# EasyEDA Pro project SK_SDVX.epro

# Schematic Controller
Board Name: ControllerBoard; Create Date: 2025-06-14; Page Name: P1; Project Name: SK_SDVX; Schematic Name: Schematic2; Update Date: 2025-06-22; Company: 嘉立创EDA
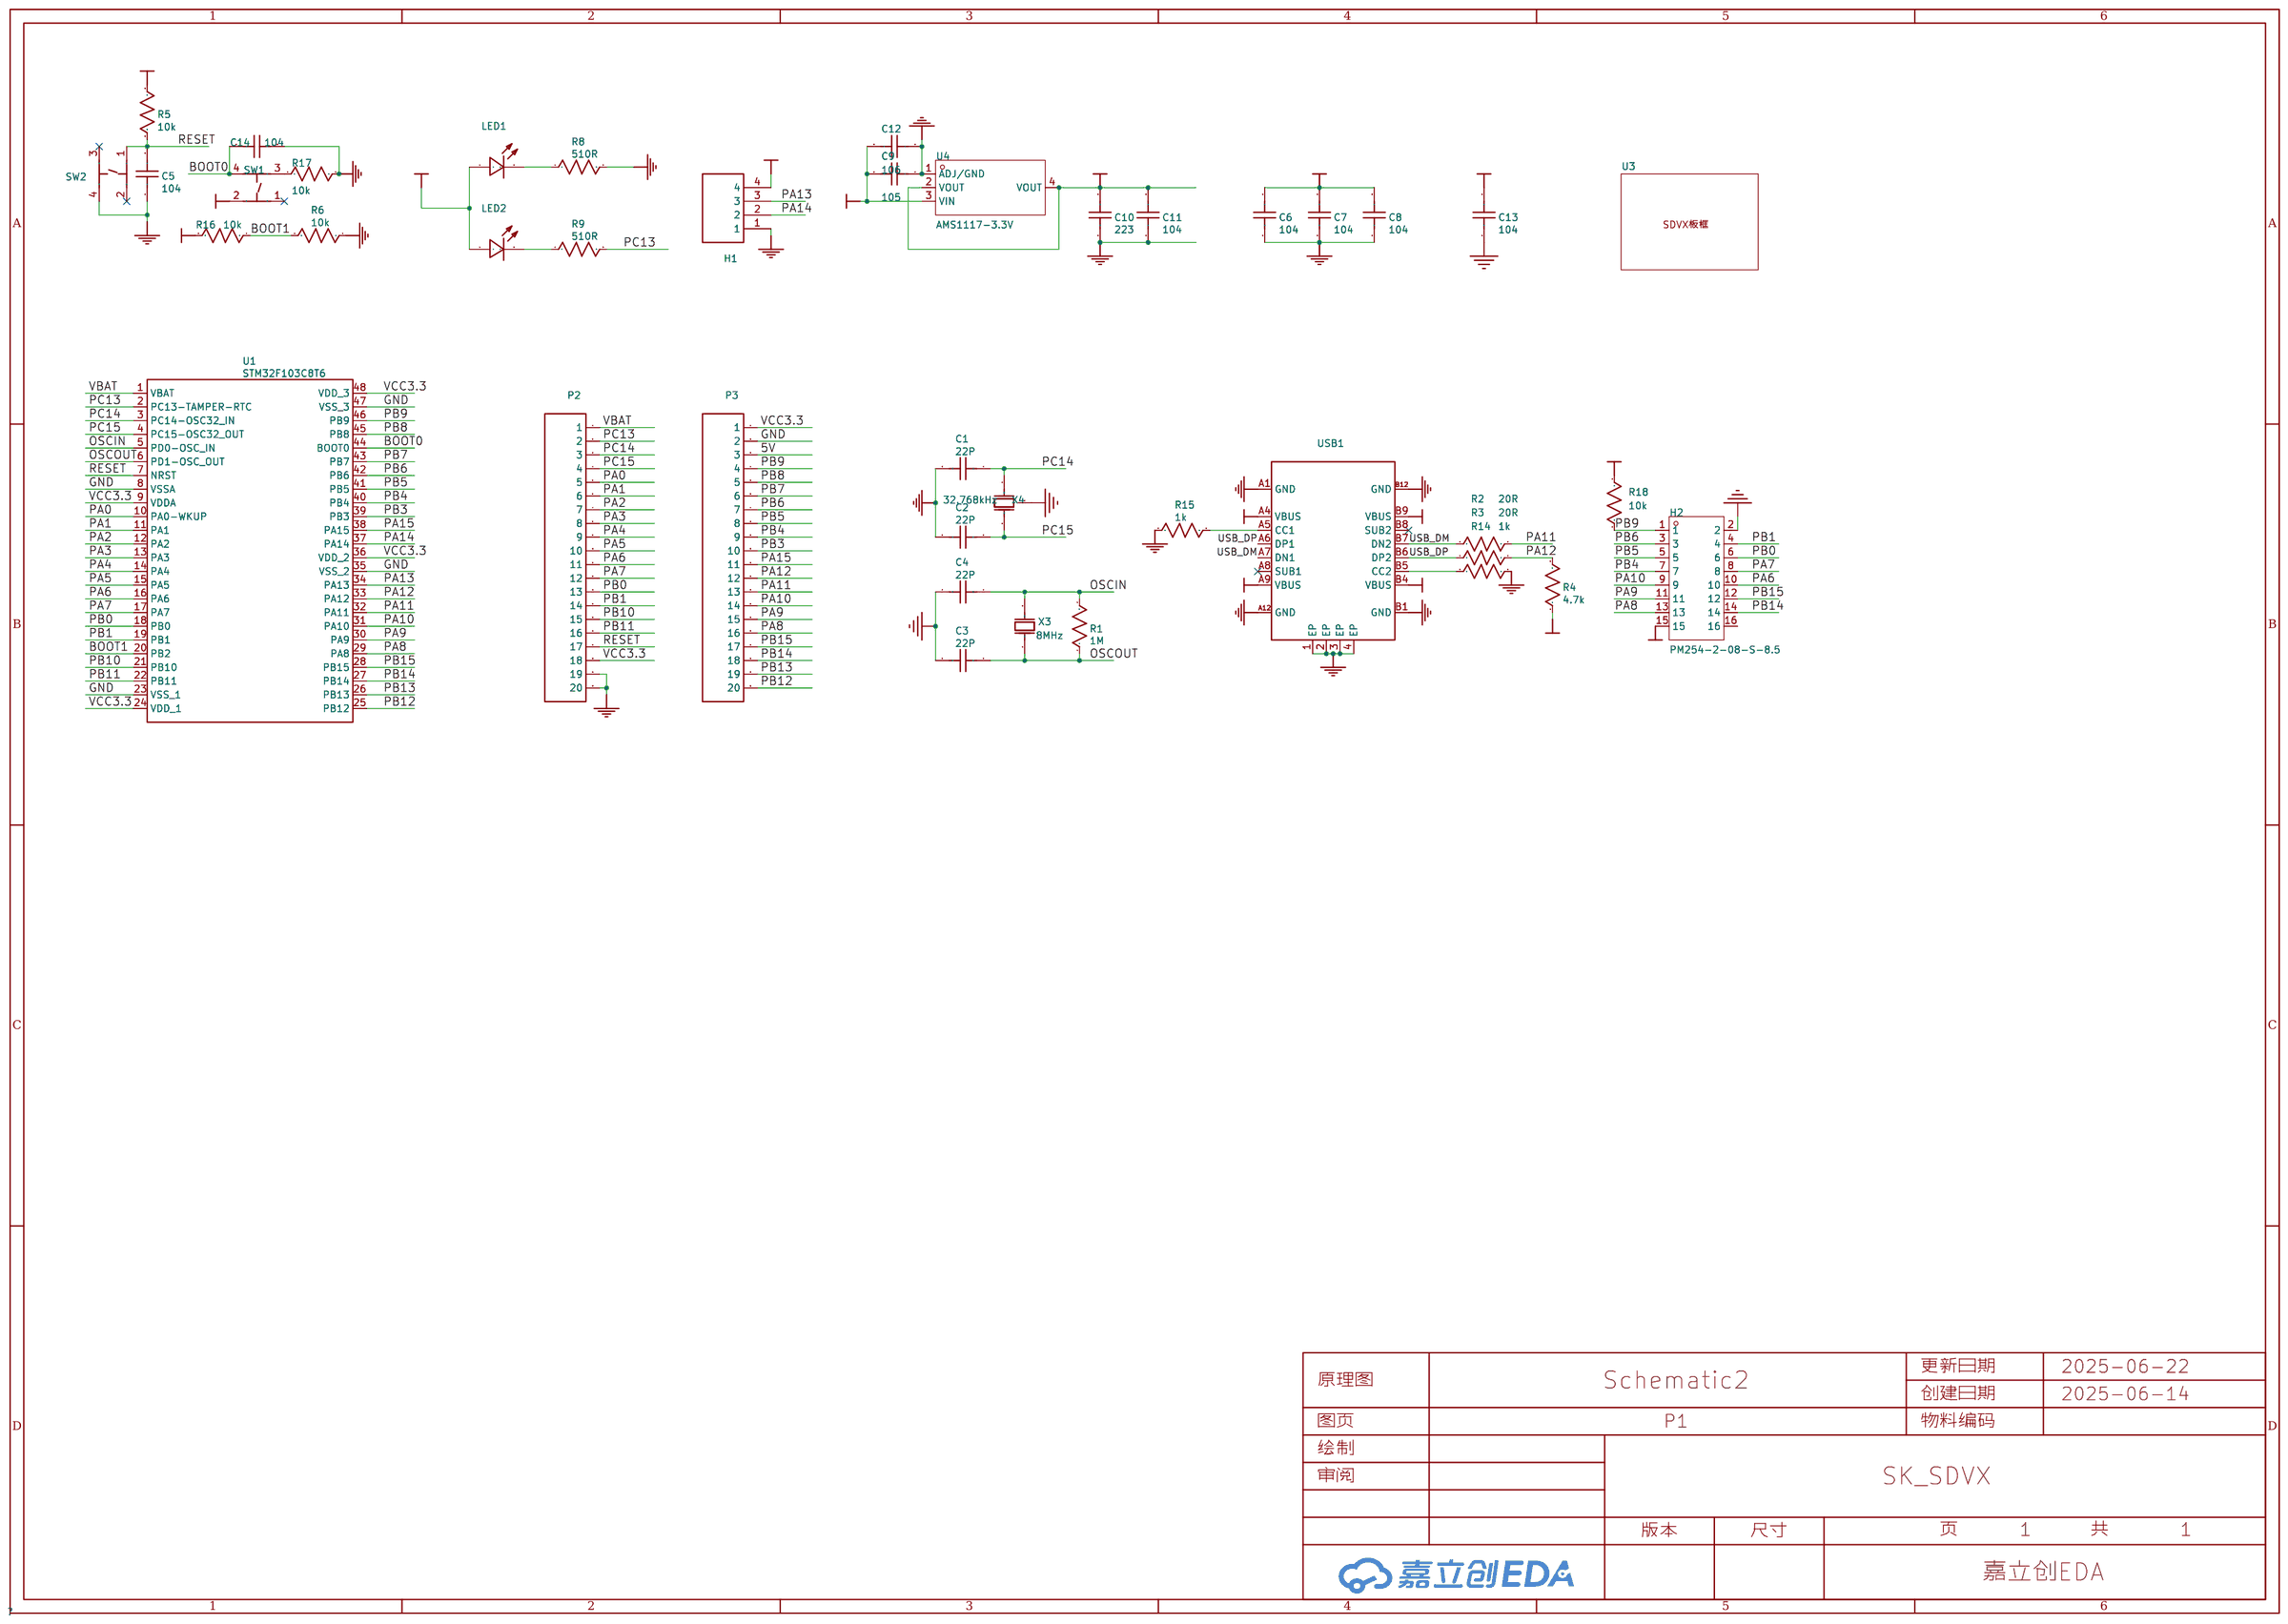
[diagram p0: schematic sheet]

## Parts
C1  22P  [C0603]
C2  22P  [C0603]
C3  22P  [C0603]
C4  22P  [C0603]
C5  104  [C0603]
C6  104  [C0603]
C7  104  [C0603]
C8  104  [C0603]
C9  105  [C0603]
C10  223  [C0603]
C11  104  [C0603]
C12  106  [C0603]
C13  104  [C0603]
C14  104  [C0603]
H1  220S-1*4P H=8.5MM Ytype Gold-plated  [DIP-1X4P2.54]
H2  PM254-2-08-S-8.5  [HDR-SMD_16P-P2.54-V-F-R2-C8-LS7.1]
LED1  204-10SURD/S530-A3  [LED0805-RD]
LED2  204-10SURD/S530-A3  [LED0805-RD]
P2  Header-Female-2.54_1x20  [HDR-TH_20P-P2.54-V]
P3  Header-Female-2.54_1x20  [HDR-TH_20P-P2.54-V]
R1  1M  [R0603]
R2  20R  [R0603]
R3  20R  [R0603]
R4  4.7k  [R0603]
R5  10k  [R0603]
R6  10k  [R0603]
R8  510R  [R0603]
R9  510R  [R0603]
R14  1k  [R0603]
R15  1k  [R0603]
R16  10k  [R0603]
R17  10k  [R0603]
R18  10k  [R0603]
SW1  3.7*3.7*0.8  [SW-SMD_4P-L3.7-W3.7-P2.75-LS3.7]
SW2  3.7*3.7*0.8  [SW-SMD_4P-L3.7-W3.7-P2.75-LS3.7]
U1  STM32F103C8T6  [LQFP-48_L7.0-W7.0-P0.50-LS9.0-BL]
U3  -  [SDVX台板框]
U4  AMS1117-3.3V  [SOT-223-4_L6.5-W3.5-P2.30-LS7.0-TR]
USB1  TYPE-C-16P  [USB-C-SMD_KH-TYPE-C-16P]
X3  8MHz  [HC-49US_L11.5-W4.5-P4.88]
X4  32.768kHz  [OSC-SMD_BD2.0-P2.54_TMXLI-206F32.768KHZ12.5PF20PPM]

## Library data of the parts
C1-C4 = 22P: nameAlias: Value(F); spicePre: C; spiceSymbolName: Cap_RAD-0.1_US
C5-C8 C11 C13 C14 = 104: nameAlias: Value(F); spicePre: C; spiceSymbolName: Cap_RAD-0.1_US
C9 = 105: nameAlias: Value(F); spicePre: C; spiceSymbolName: Cap_RAD-0.1_US
C10 = 223: nameAlias: Value(F); spicePre: C; spiceSymbolName: Cap_RAD-0.1_US
C12 = 106: nameAlias: Value(F); spicePre: C; spiceSymbolName: Cap_RAD-0.1_US
H1 = 220S-1*4P H=8.5MM Ytype Gold-plated: Supplier: LCSC; Manufacturer: Ckmtw; Supplier Part: C124413; Contributor: LCSC; spicePre: H
H2 = PM254-2-08-S-8.5: 插孔结构:2x8P;间距:2.54mm;行距:2.54mm;圆孔/方孔:方孔;安装类型:立贴;排数:双排;总孔位数:16P;额定电流:3A;插孔方向:顶部;塑高:8.5mm;触头材质:铜合金;工作温度范围:-40℃~+105℃;焊接温度(最大值):260℃@5S;; LCSC Part Name: 2x8P 间距:2.54mm 立贴; Supplier Part: C3975153; Manufacturer: HCTL(华灿天禄); Supplier Footprint: SMD,P=2.54mm; JLCPCB Part Class: 扩展库; Datasheet: https://atta.szlcsc.com/upload/public/pdf/source/20230609/7C6F8D8E301C6BBC8F19D55951C36597.pdf; Supplier: LCSC; Holes Structure: 2x8P; Pitch: 2.54mm; Row Spacing: 2.54mm; Circular Hole / Square Hole: 方孔; Mounting Type: 立贴; Number of Rows: 双排; Number of Holes: 16P; Current Rating (Max): 3A; Holes Direction: 顶部; Insulation Height: 8.5mm; Contact Material: 铜合金; Operating Temperature Range: -40℃~+105℃; Soldering Temperature(Max): 260℃@5S
LED1 LED2 = 204-10SURD/S530-A3: Supplier: LCSC; Manufacturer: EVERLIGHT; Supplier Part: C99772; spicePre: L
P2 P3 = 2.54mm 1*20P Female header: Supplier: LCSC; Manufacturer: BOOMELE; Supplier Part: C50984; spicePre: P
R1 = 1M: nameAlias: Value(Ω); spicePre: R; spiceSymbolName: Res_AXIAL-0.3(1/8W)_US
R2 R3 = 20R: nameAlias: Value(Ω); spicePre: R; spiceSymbolName: Res_AXIAL-0.3(1/8W)_US
R4 = 4.7k: nameAlias: Value(Ω); spicePre: R; spiceSymbolName: Res_AXIAL-0.3(1/8W)_US
R5 R6 R16 R17 = 10k: nameAlias: Value(Ω); spicePre: R; spiceSymbolName: Res_AXIAL-0.3(1/8W)_US
R8 R9 = 510R: nameAlias: Value(Ω); spicePre: R; spiceSymbolName: Res_AXIAL-0.3(1/8W)_US
R14 R15 R18 = 1k: nameAlias: Value(Ω); Contributor: LCEDA_Lib; spicePre: R; spiceSymbolName: R_0603_US
SW1 SW2 = 3.7*3.7*0.8: Supplier: LCSC; Supplier Part: C2888445; Manufacturer: BZCN(博众电气); Manufacturer Part: TSA005A3518A02; JLCPCB Part Class: Extended Part; Contributor: LCSC; spicePre: S; spiceSymbolName: TSA005A3518A02
U1 = STM32F103C8T6: Supplier: LCSC; Manufacturer: STMicroelectronics; image: //image.lceda.cn/szlcsc/C8734.jpg; Supplier Part: C8734; JLCPCB Part Class: Basic; timeStamp: 1455028086; spicePre: U
U3 = SDVX台板框
U4 = AMS1117-3.3V: 输出类型:固定;最大输入电压:18V;输出电压:3.3V;最大输出电流:1A;输出极性:正极;; LCSC Part Name: 输入18V 输出3.3V 1A; Supplier Part: C5120765; Manufacturer: MSKSEMI(美森科); Supplier Footprint: SOT-223; JLCPCB Part Class: 扩展库; Datasheet: https://atta.szlcsc.com/upload/public/pdf/source/20230802/7000FCAFF33971783A269E7BD69EFE08.pdf; Supplier: LCSC; Output Type: 固定; Maximum Input Voltage: 18V; Output Voltage: 3.3V; MAX Output Current: 1A; Dropout Voltage: 1.4V@(1A); standby current: 12mA; Operating Temperature: 0℃~+125℃; Output Polarity: 正极; Number of Outputs: 1
USB1 = TYPE-C-16P: Supplier: LCSC; Supplier Part: C709357; Manufacturer: kinghelm(金航标); Manufacturer Part: KH-TYPE-C-16P; Contributor: LCSC; spicePre: U; spiceSymbolName: KH-TYPE-C-16P
X3 = 8MHz: Supplier: LCSC; Manufacturer: HOSONIC(鸿星); Manufacturer Part: E49A8E00000FE10CO; Supplier Part: C111806; JLCPCB Part Class: Extended Part; nameAlias: Value; spicePre: X; spiceSymbolName: E49A8E00000FE10CO
X4 = 32.768kHz: Supplier: LCSC; Supplier Part: C164061; Manufacturer: YJX(雅晶鑫); Manufacturer Part: TAXM32768KBGBAZN2T; JLCPCB Part Class: Extended Part; nameAlias: Value; Contributor: LCSC; spicePre: X; spiceSymbolName: TMXLI-206F32.768KHZ12PF10PPM

## Nets
5V: C9.2 C12.2 C13.2 H2.15 P3.3 R4.1 R18.2 U4.3(VIN) USB1.A4(VBUS) USB1.A9(VBUS) USB1.B4(VBUS) USB1.B9(VBUS)
GND: C1.2 C2.2 C3.2 C4.2 C5.1 C6.1 C7.1 C8.1 C9.1 C10.1 C11.1 C12.1 C13.1 C14.2 H1.1 H2.2 P2.19 P2.20 P3.2 R6.1 R8.2 R14.2 R15.1 R17.2 SW2.4 U1.8(VSSA) U1.23(VSS_1) U1.35(VSS_2) U1.47(VSS_3) U4.1(ADJ/GND) USB1.1(EP) USB1.2(EP) USB1.3(EP) USB1.4(EP) USB1.A1(GND) USB1.A12(GND) USB1.B1(GND) USB1.B12(GND) X4.3
VBAT: P2.1 U1.1(VBAT)
VCC3.3: C6.2 C7.2 C8.2 C10.2 C11.2 H1.4 LED1.1(A) LED2.1(A) P2.18 P3.1 R5.2 R16.2 SW1.2 U1.9(VDDA) U1.24(VDD_1) U1.36(VDD_2) U1.48(VDD_3) U4.2(VOUT) U4.4(VOUT)
BOOT0: C14.1 SW1.4 U1.44(BOOT0)
BOOT1: R6.2 R16.1 U1.20(PB2)
OSCIN: C4.1 R1.2 U1.5(PD0-OSC_IN) X3.2(OSC2)
OSCOUT: C3.1 R1.1 U1.6(PD1-OSC_OUT) X3.1(OSC1)
PA0: P2.5 U1.10(PA0-WKUP)
PA1: P2.6 U1.11(PA1)
PA2: P2.7 U1.12(PA2)
PA3: P2.8 U1.13(PA3)
PA4: P2.9 U1.14(PA4)
PA5: P2.10 U1.15(PA5)
PA6: H2.10 P2.11 U1.16(PA6)
PA7: H2.8 P2.12 U1.17(PA7)
PA8: H2.13 P3.16 U1.29(PA8)
PA9: H2.11 P3.15 U1.30(PA9)
PA10: H2.9 P3.14 U1.31(PA10)
PA11: P3.13 R2.2 U1.32(PA11)
PA12: P3.12 R3.2 R4.2 U1.33(PA12)
PA13: H1.3 U1.34(PA13)
PA14: H1.2 U1.37(PA14)
PA15: P3.11 U1.38(PA15)
PB0: H2.6 P2.13 U1.18(PB0)
PB1: H2.4 P2.14 U1.19(PB1)
PB3: P3.10 U1.39(PB3)
PB4: H2.7 P3.9 U1.40(PB4)
PB5: H2.5 P3.8 U1.41(PB5)
PB6: H2.3 P3.7 U1.42(PB6)
PB7: P3.6 U1.43(PB7)
PB8: P3.5 U1.45(PB8)
PB9: H2.1 P3.4 R18.1 U1.46(PB9)
PB10: P2.15 U1.21(PB10)
PB11: P2.16 U1.22(PB11)
PB12: P3.20 U1.25(PB12)
PB13: P3.19 U1.26(PB13)
PB14: H2.14 P3.18 U1.27(PB14)
PB15: H2.12 P3.17 U1.28(PB15)
PC13: P2.2 R9.2 U1.2(PC13-TAMPER-RTC)
PC14: C1.1 P2.3 U1.3(PC14-OSC32_IN) X4.1(OSC1)
PC15: C2.1 P2.4 U1.4(PC15-OSC32_OUT) X4.2(OSC2)
RESET: C5.2 P2.17 R5.1 SW2.1 U1.7(NRST)
USB_DM: R2.1 USB1.A7(DN1) USB1.B7(DN2)
USB_DP: R3.1 USB1.A6(DP1) USB1.B6(DP2)
$3N30531: LED1.2(K) R8.1
$3N30532: LED2.2(K) R9.1
$3N30903: R14.1 USB1.B5(CC2)
$3N30904: R15.2 USB1.A5(CC1)
$3N31755: R17.1 SW1.3

Not connected (* = marked no-connect by the designer): H2 16; SW1 1*; SW2 2* 3*; USB1 A8(SUB1)* B8(SUB2)*

# Schematic Position
Board Name: PosisionBoard; Create Date: 2025-06-14; Page Name: P1; Project Name: SK_SDVX; Schematic Name: Schematic3; Update Date: 2025-06-14; Company: 嘉立创EDA; Page Size: A3; Version: V1.0
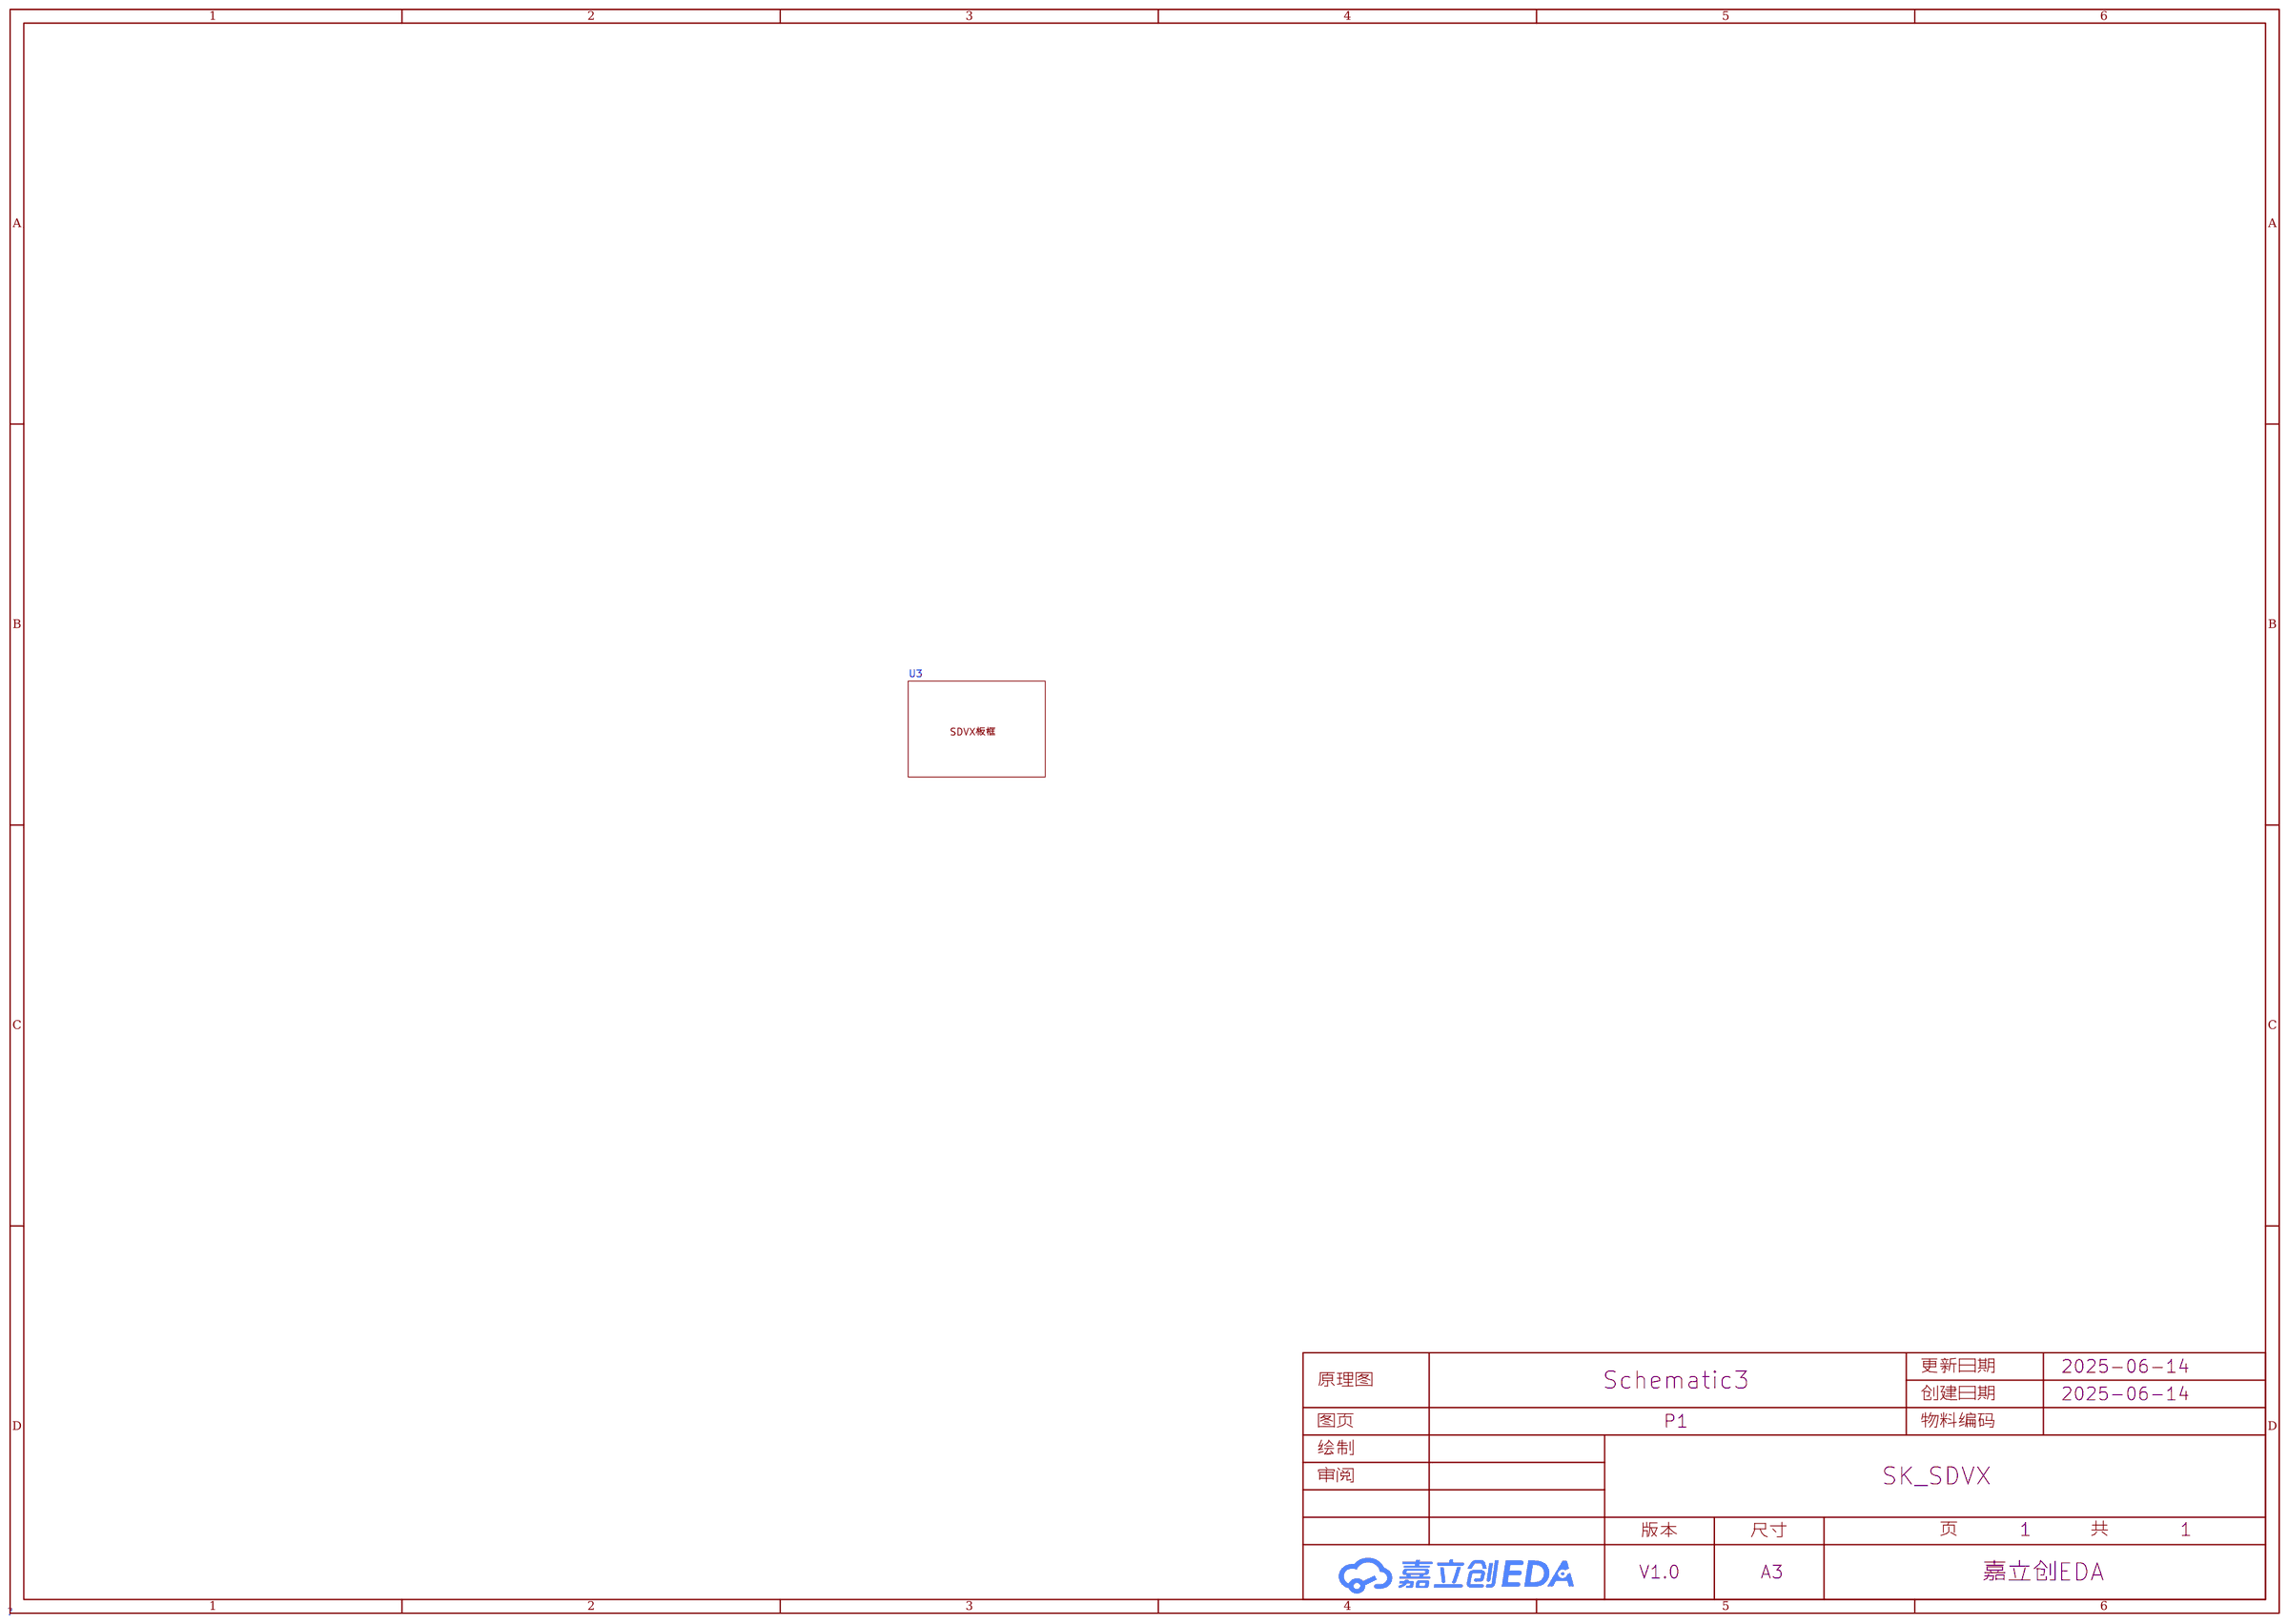
[diagram p1: schematic sheet]

## Parts
U3  -  [SDVX台板框]

## Library data of the parts
U3 = SDVX台板框

## Nets

# Schematic Key_Board
Board Name: UpperBoard; Create Date: 2025-06-14; Page Name: P1; Project Name: SK_SDVX; Schematic Name: Schematic1; Update Date: 2025-06-21; Company: 嘉立创EDA
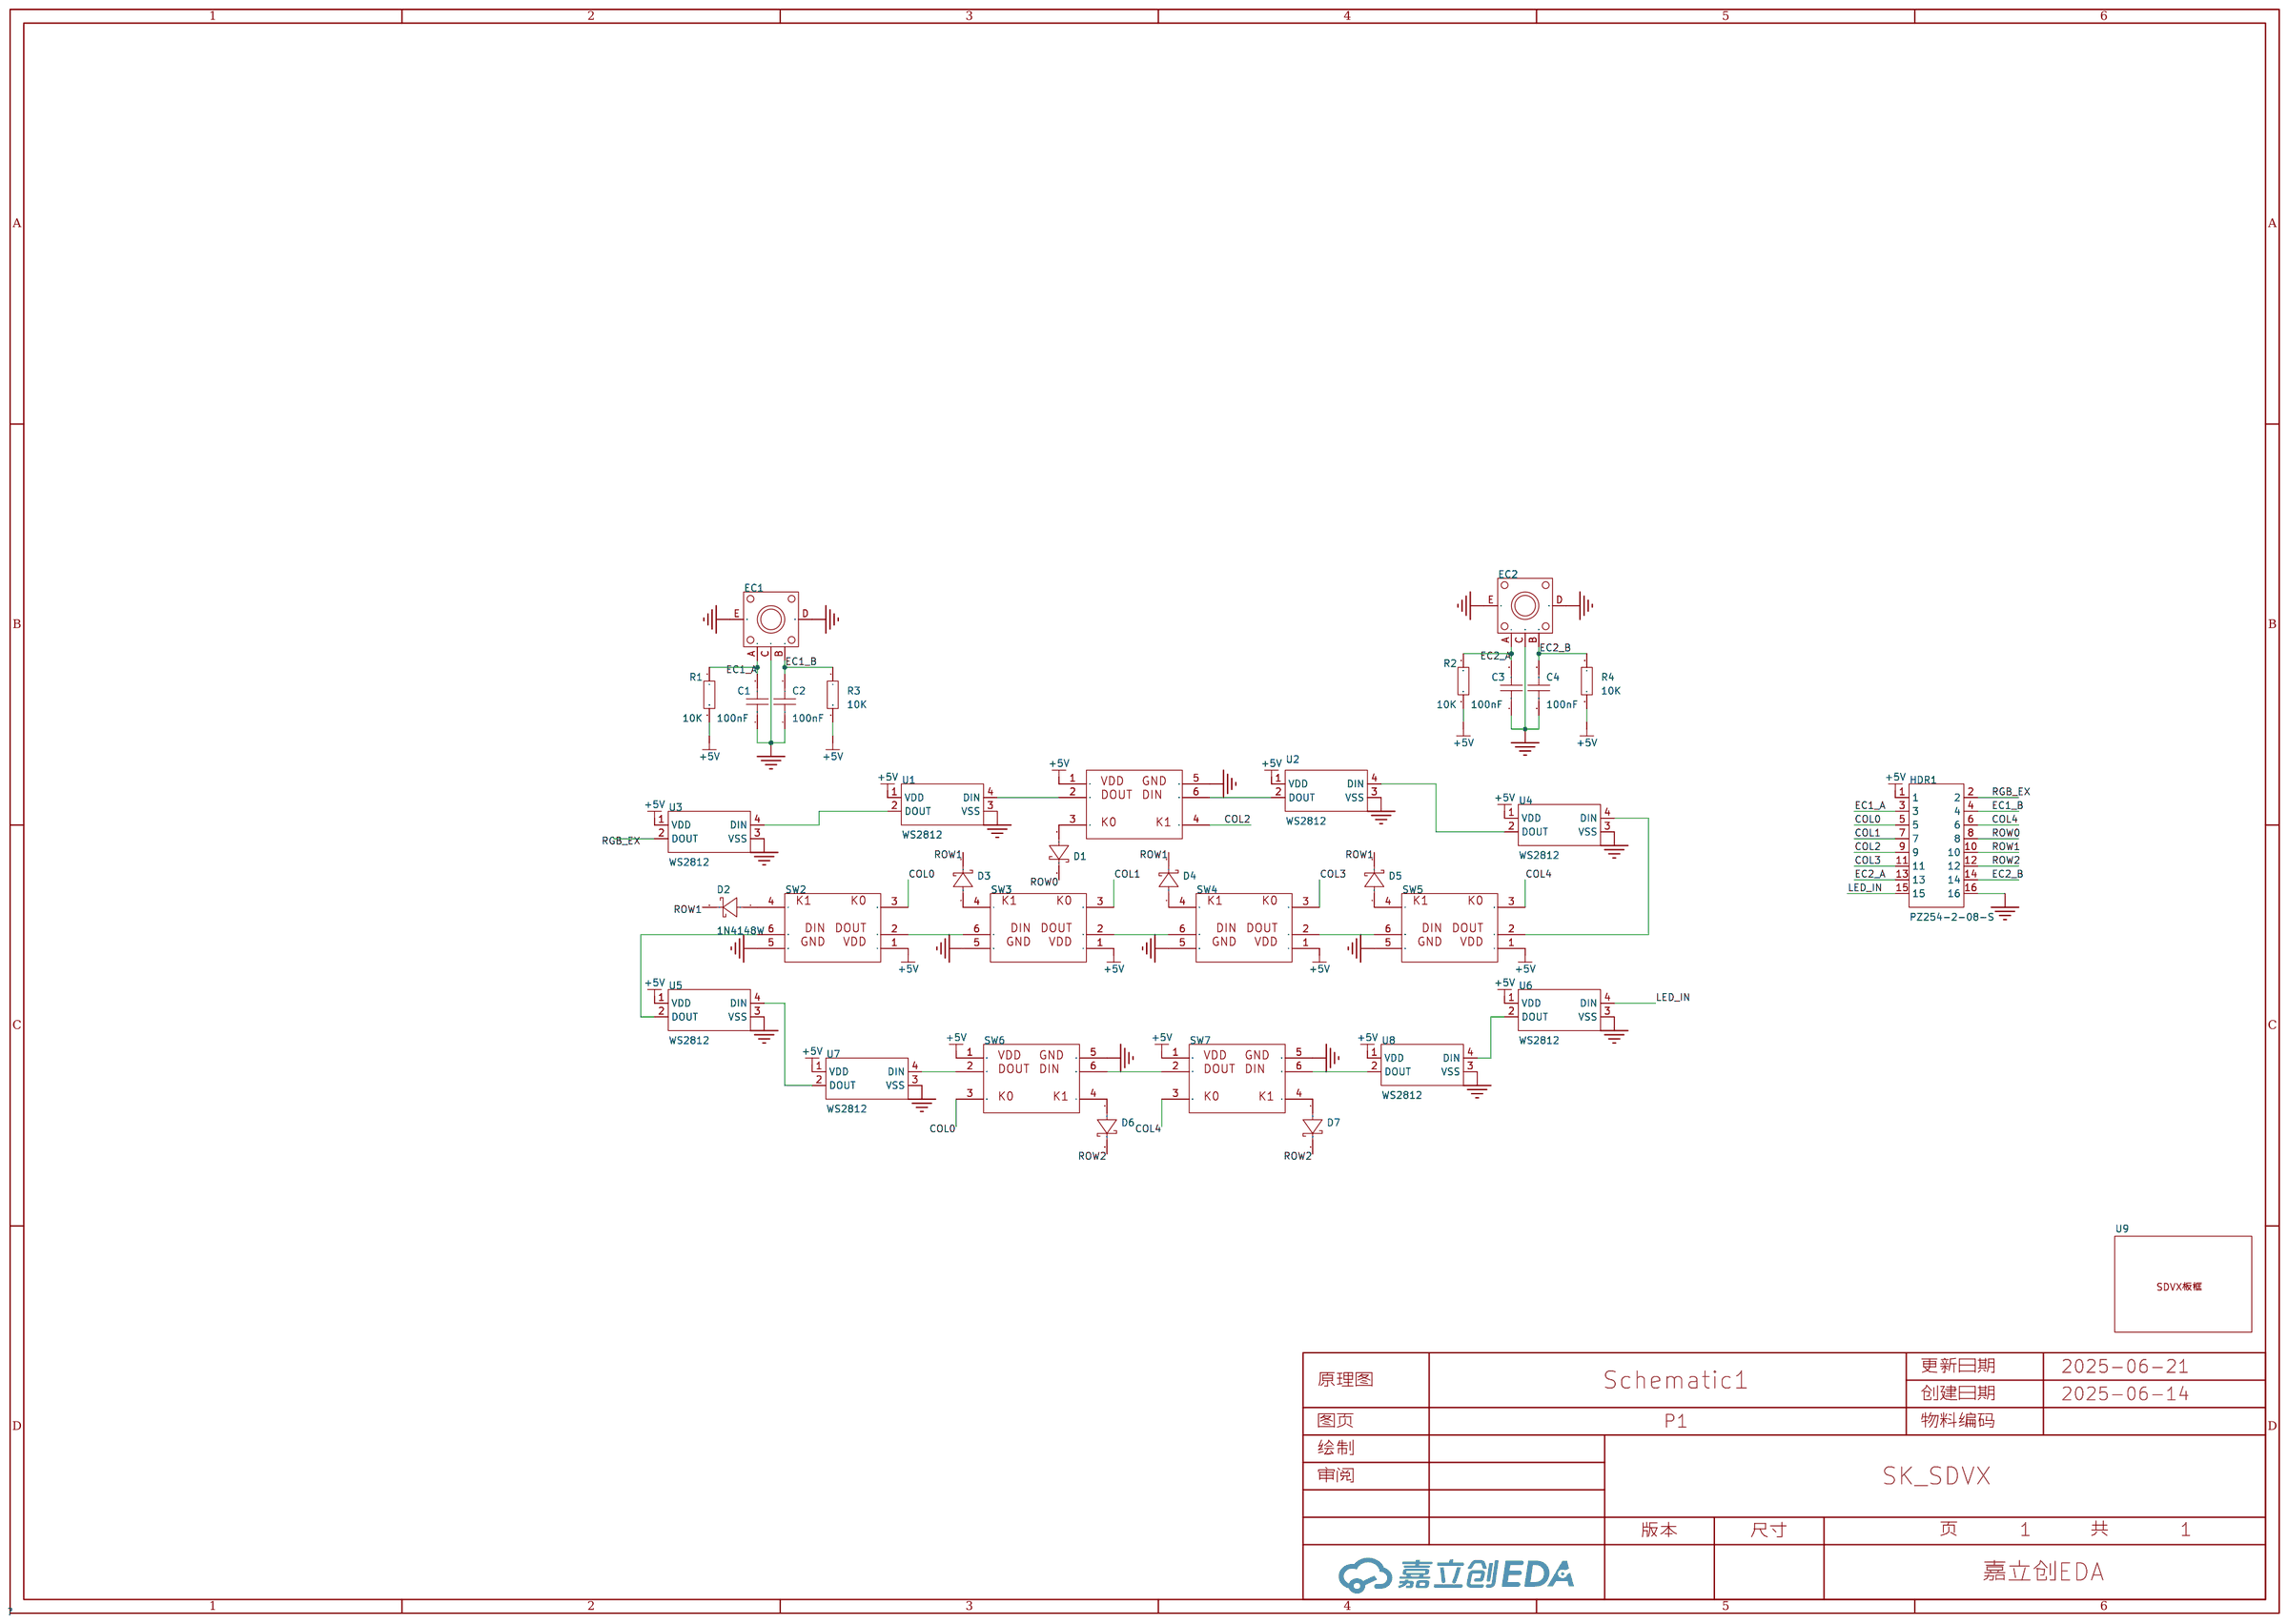
[diagram p2: schematic sheet]

## Parts
C1  100nF  [C0603]
C2  100nF  [C0603]
C3  100nF  [C0603]
C4  100nF  [C0603]
D1  1N4148W  [SOD-123_L2.7-W1.6-LS3.7-FD]
D2  1N4148W  [SOD-123_L2.7-W1.6-LS3.7-FD]
D3  1N4148W  [SOD-123_L2.7-W1.6-LS3.7-FD]
D4  1N4148W  [SOD-123_L2.7-W1.6-LS3.7-FD]
D5  1N4148W  [SOD-123_L2.7-W1.6-LS3.7-FD]
D6  1N4148W  [SOD-123_L2.7-W1.6-LS3.7-FD]
D7  1N4148W  [SOD-123_L2.7-W1.6-LS3.7-FD]
EC1  -  [SW-TH_EC12EXXXX]
EC2  -  [SW-TH_EC12EXXXX]
HDR1  PZ254-2-08-S  [HDR-SMD_16P-P2.54-V-M-R2-C8-S7.4]
R1  10K  [R0603]
R2  10K  [R0603]
R3  10K  [R0603]
R4  10K  [R0603]
SW1  凯华轴座  [凯华轴座+3528反贴灯]
SW2  凯华轴座  [凯华轴座+3528反贴灯]
SW3  凯华轴座  [凯华轴座+3528反贴灯]
SW4  凯华轴座  [凯华轴座+3528反贴灯]
SW5  凯华轴座  [凯华轴座+3528反贴灯]
SW6  凯华轴座  [凯华轴座+3528反贴灯]
SW7  凯华轴座  [凯华轴座+3528反贴灯]
U1  WS2812  [LED-SMD_4P-L5.0-W5.0-TL-A]
U2  WS2812  [LED-SMD_4P-L5.0-W5.0-TL-A]
U3  WS2812  [LED-SMD_4P-L5.0-W5.0-TL-A]
U4  WS2812  [LED-SMD_4P-L5.0-W5.0-TL-A]
U5  WS2812  [LED-SMD_4P-L5.0-W5.0-TL-A]
U6  WS2812  [LED-SMD_4P-L5.0-W5.0-TL-A]
U7  WS2812  [LED-SMD_4P-L5.0-W5.0-TL-A]
U8  WS2812  [LED-SMD_4P-L5.0-W5.0-TL-A]
U9  -  [SDVX台板框]

## Library data of the parts
C1-C4 = CAP_0603: Supplier Footprint: 0603
D1-D7 = 1N4148W_C7420318: 二极管配置:独立式;正向压降(Vf):1.25V@150mA;直流反向耐压(Vr):100V;整流电流:150mA;反向恢复时间(trr):4ns;; Supplier Part: C7420318; Manufacturer: 宏迦橙; Supplier Footprint: SOD-123; JLCPCB Part Class: 扩展库; Datasheet: https://atta.szlcsc.com/upload/public/pdf/source/20230828/E5C3F7A4272052930A7E03B75759BF50.pdf; Supplier: LCSC; Diode Configuration: 独立式; Forward Voltage (Vf@If): 1.25V@150mA; Reverse Voltage (Vr): 100V; Rectified Current: 150mA; Reverse Leakage Current (Ir): 1uA@75V; Reverse Recovery Time (trr): 4ns; Operating Temperature: -55℃~+150℃
EC1 EC2 = EC12: LCSC Part Name: EC12E24404A8; Supplier Part: C470600; Manufacturer: ALPSALPINE(阿尔卑斯阿尔派); Manufacturer Part: EC12E24404A8; Supplier Footprint: 插件; JLCPCB Part Class: 扩展库; Datasheet: https://atta.szlcsc.com/upload/public/pdf/source/20191216/C470600_B330412665C9BC4120C1E09FF518B6F2.pdf; Supplier: LCSC
HDR1 = PZ254-2-08-S: 插针结构:2x8P;间距:2.54mm;行距:2.54mm;圆针/方针:方针;安装方式:立贴;排数:双排;总PIN位数:16P;额定电流:3A;额定电压:250V;配合针长度:6mm;塑高:2.5mm;端接针长度:-;工作温度:-40℃~+105℃;颜色:黑色;; LCSC Part Name: 黑色 2x8P 间距:2.54mm 方针 立贴; Supplier Part: C3294466; Manufacturer: HCTL(华灿天禄); Supplier Footprint: SMD,P=2.54mm; JLCPCB Part Class: 扩展库; Datasheet: https://atta.szlcsc.com/upload/public/pdf/source/20230609/FB2B5B924AA338E6CB93C3BD1D012B72.pdf; Supplier: LCSC; Pin Structure: 2x8P; Pitch: 2.54mm; Row Spacing: 2.54mm; Circluar Pins/Square Pins: 方针; Mounting Type: 立贴; Number of Rows: 双排; Number of Pins: 16P; Current Rating: 3A; Voltage Rating (Max): 250V; Length of Mating Pin: 6mm; Insulation Height: 2.5mm; Operating Temperature: -40℃~+105℃; Color: 黑色
R1-R4 = Res_0603: Supplier Footprint: 0603
SW1-SW7 = 凯华轴座: Pin Type: IN
U1-U8 = WS2812: RGB三色灯珠，5050RGB集成光源内置IC幻彩灯珠单点单控5V，高性价比，12mA; Supplier Part: C42417498; Manufacturer: worldsemi; Supplier Footprint: SMD5050-4P; JLCPCB Part Class: 扩展库; Datasheet: https://atta.szlcsc.com/upload/public/pdf/source/20241220/DE49FA134DE3BC32DD41246C16D24E19.pdf; Supplier: LCSC
U9 = SDVX台板框

## Nets
+5V: HDR1.1 R1.2 R2.2 R3.2 R4.2 SW1.1 SW2.1 SW3.1 SW4.1 SW5.1 SW6.1 SW7.1 U1.1(VDD) U2.1(VDD) U3.1(VDD) U4.1(VDD) U5.1(VDD) U6.1(VDD) U7.1(VDD) U8.1(VDD)
GND: C1.1 C2.1 C3.1 C4.1 EC1.C EC1.D EC1.E EC2.C EC2.D EC2.E HDR1.16 SW1.5 SW2.5 SW3.5 SW4.5 SW5.5 SW6.5 SW7.5 U1.3(VSS) U2.3(VSS) U3.3(VSS) U4.3(VSS) U5.3(VSS) U6.3(VSS) U7.3(VSS) U8.3(VSS)
COL0: HDR1.5 SW2.3 SW6.3
COL1: HDR1.7 SW3.3
COL2: HDR1.9 SW1.4
COL3: HDR1.11 SW4.3
COL4: HDR1.6 SW5.3 SW7.3
EC1_A: C1.2 EC1.A HDR1.3 R1.1
EC1_B: C2.2 EC1.B HDR1.4 R3.1
EC2_A: C3.2 EC2.A HDR1.13 R2.1
EC2_B: C4.2 EC2.B HDR1.14 R4.1
LED_IN: HDR1.15 U6.4(DIN)
RGB_EX: HDR1.2 U3.2(DOUT)
ROW0: D1.2(K) HDR1.8
ROW1: D2.2(K) D3.2(K) D4.2(K) D5.2(K) HDR1.10
ROW2: D6.2(K) D7.2(K) HDR1.12
$1N16056: SW2.2 SW3.6
$1N16215: SW4.2 SW5.6
$1N26478: SW3.2 SW4.6
$1N26488: U6.2(DOUT) U8.4(DIN)
$1N26494: SW7.6 U8.2(DOUT)
$1N26499: SW6.6 SW7.2
$1N26504: SW6.2 U7.4(DIN)
$1N26509: U5.4(DIN) U7.2(DOUT)
$1N26516: SW2.6 U5.2(DOUT)
$1N26529: SW1.6 U2.2(DOUT)
$1N26533: SW1.2 U1.4(DIN)
$1N26544: U2.4(DIN) U4.2(DOUT)
$1N26550: SW5.2 U4.4(DIN)
$1N26556: U1.2(DOUT) U3.4(DIN)
$1N28171: D2.1(A) SW2.4
$1N28248: D3.1(A) SW3.4
$1N28294: D4.1(A) SW4.4
$1N28343: D5.1(A) SW5.4
$1N28396: D6.1(A) SW6.4
$1N28439: D7.1(A) SW7.4
$1N29403: D1.1(A) SW1.3

# Board Controller_Board
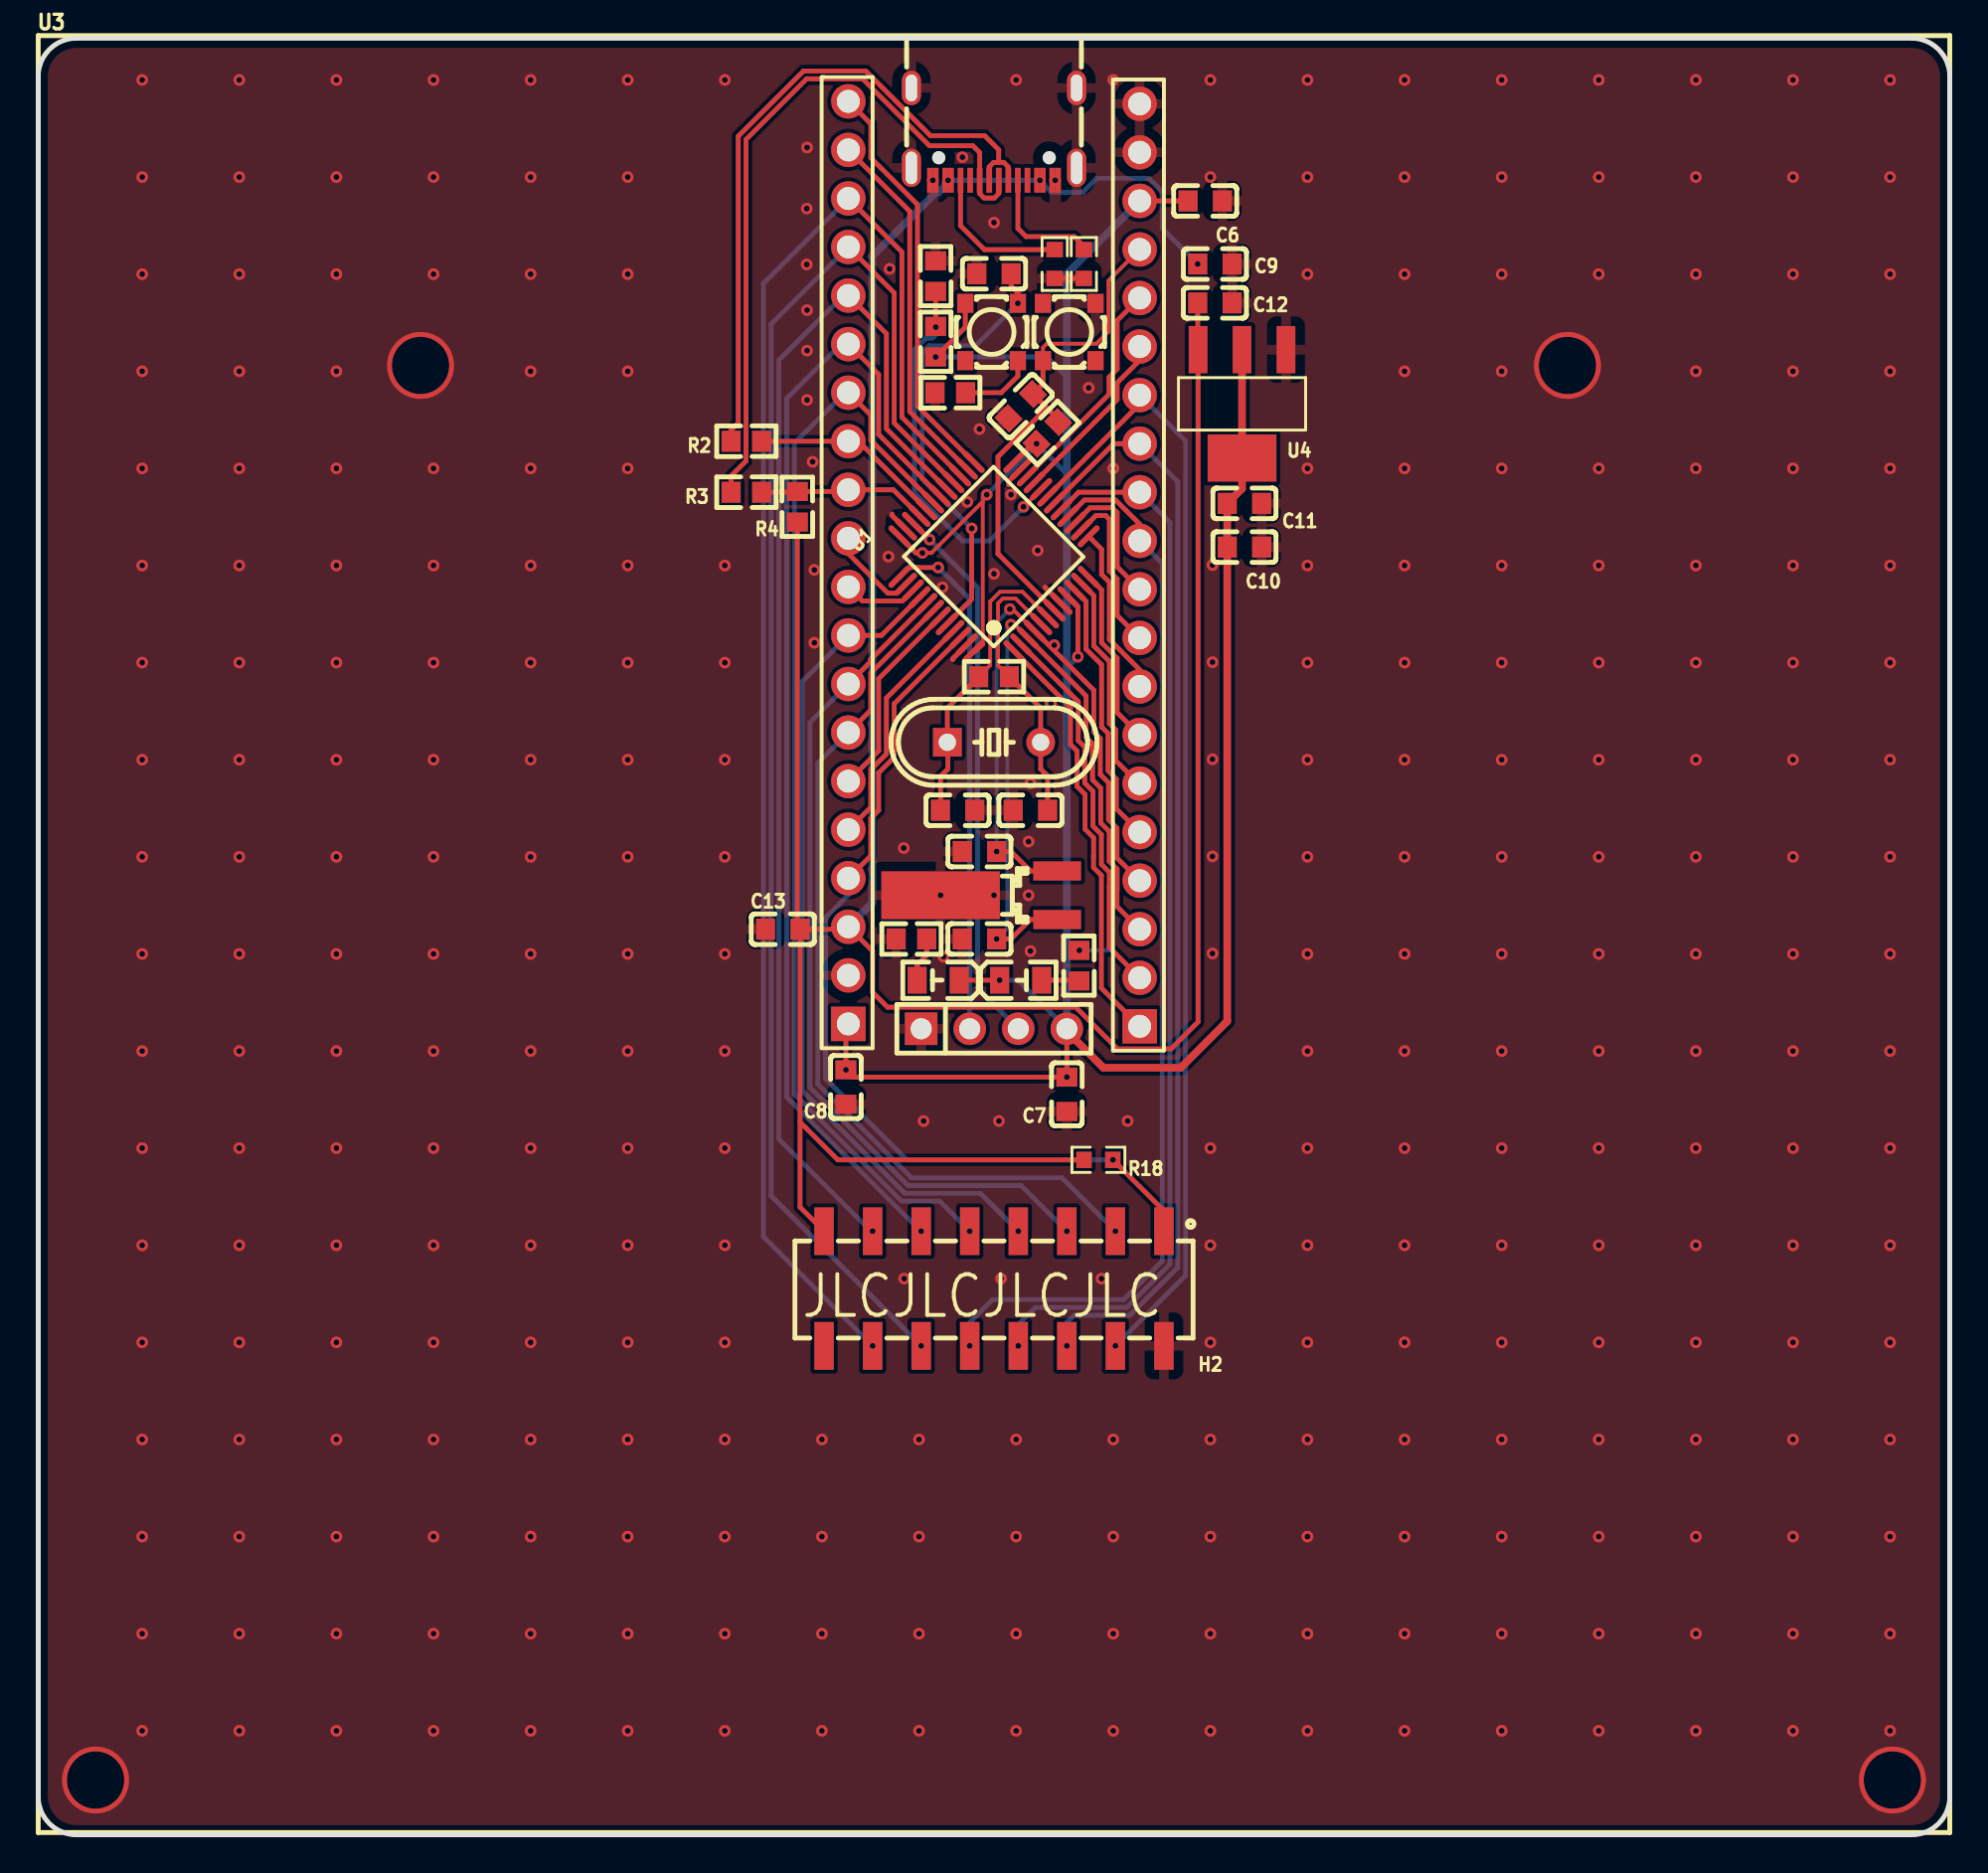
[diagram p3: board, top side]
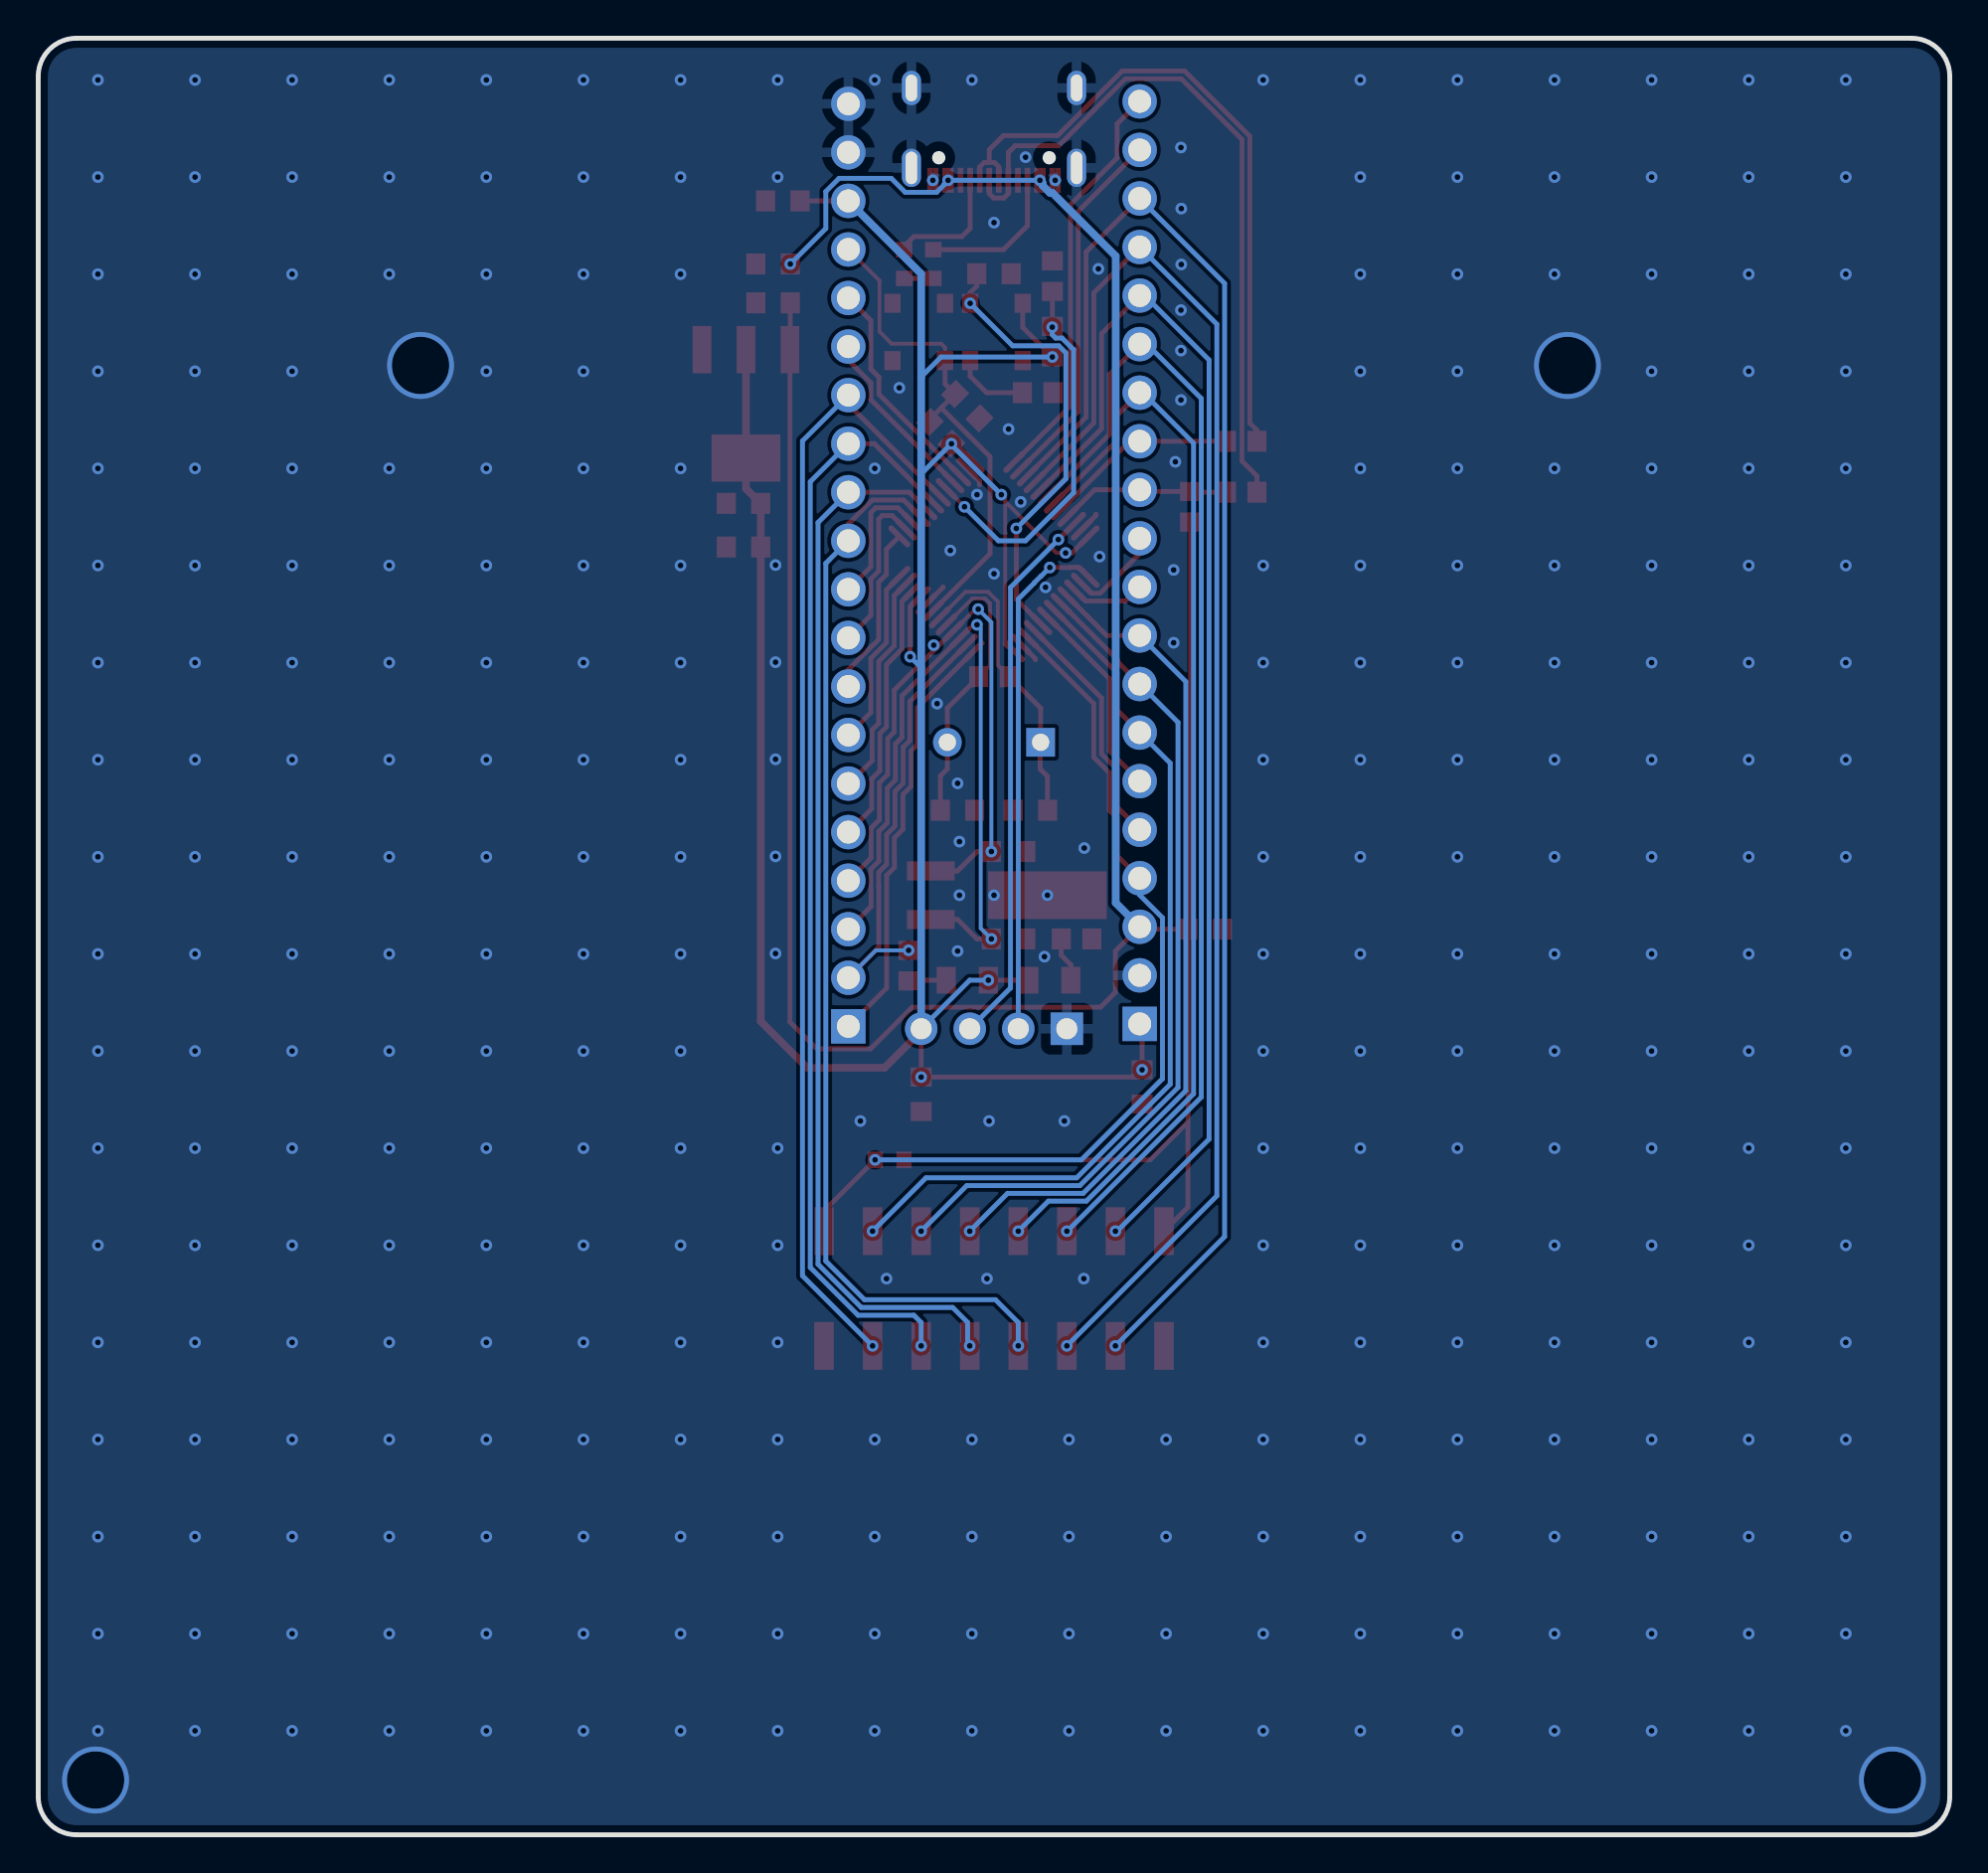
[diagram p4: board, bottom side, seen from below]

Outline 100 x 93.98 mm; copper layers: Top Layer, Bottom Layer. Coordinates in mm from the lower left corner of the outline.
Outline path: 0,91.98 0,2 arc(0.59,0.59) 2,0 98,0 arc(99.41,0.59) 100,2 100,91.98 arc(99.41,93.39) 98,93.98 2,93.98 arc(0.59,93.39) 0,91.98
Stack: Top Layer 0.035mm / Dielectric1 1.51mm FR4 er 4.5 / Bottom Layer 0.035mm

## Design rules (mm)
template: 用户自定义配置
spacing safeClearance (default): track to track 0.152, other pairs 0.152 to 0.3
track width trackWidth (default): min 0.127, default 0.254, max 2.54
track width trackWidth1: min 0.127, default 0.508, max 2.54
differential pair differentialPair (default): width min 0.127, default 0.254, max 2.54; gap min 0.152, default 0.152
via viaSize (default): diameter min 0.5, default 0.61, max 10; hole min 0.3, default 0.305, max 5.999

## Placement (name value [footprint] x y rotation side)
C1  22P  [C0603]  49.24 46.86 180 top
C2  22P  [C0603]  49.24 51.44 180 top
C3  22P  [C0603]  48.09 53.59 0 top
C4  22P  [C0603]  51.91 53.59 180 top
C5  104  [C0603]  51.4 74.73 45 top
C6  104  [C0603]  61.05 85.47 180 top
C7  104  [C0603]  53.81 38.73 90 top
C8  104  [C0603]  42.25 39.12 90 top
C9  105  [C0603]  61.56 82.17 180 top
C10  223  [C0603]  63.1 67.36 180 top
C11  104  [C0603]  63.1 69.65 180 top
C12  106  [C0603]  61.56 80.14 180 top
C13  104  [C0603]  38.95 47.37 0 top
C14  104  [C0603]  50 81.66 180 top
H1  220S-1*4P H=8.5MM Ytype Gold-plated  [DIP-1X4P2.54]  50 42.16 0 top
H2  PM254-2-08-S-8.5  [HDR-SMD_16P-P2.54-V-F-R2-C8-LS7.1]  50 28.57 180 top
LED1  204-10SURD/S530-A3  [LED0805-RD]  47.08 44.7 180 top
LED2  204-10SURD/S530-A3  [LED0805-RD]  51.4 44.7 0 top
P2  Header-Female-2.54_1x20  [HDR-TH_20P-P2.54-V]  57.62 66.42 90 top
P3  Header-Female-2.54_1x20  [HDR-TH_20P-P2.54-V]  42.38 66.55 90 top
R1  1M  [R0603#2]  50 60.58 0 top
R2  20R  [R0603#2]  37.05 72.9 0 top
R3  20R  [R0603#2]  37.05 70.23 0 top
R4  4.7k  [R0603#2]  39.71 69.47 90 top
R5  10k  [R0603#2]  52.79 73.34 225 top
R6  10k  [R0603#2]  46.95 81.53 270 top
R8  510R  [R0603#2]  45.68 46.86 180 top
R9  510R  [R0603#2]  54.44 45.47 90 top
R14  1k  [R0603]  53.18 82.17 270 top
R15  1k  [R0603]  54.7 82.17 90 top
R16  10k  [R0603#2]  46.95 78.11 270 top
R17  10k  [R0603#2]  47.71 75.44 180 top
R18  10k  [R0603]  55.46 35.31 180 top
SW1  3.7*3.7*0.8  [SW-SMD_4P-L3.7-W3.7-P2.75-LS3.7]  49.87 78.61 90 top
SW2  3.7*3.7*0.8  [SW-SMD_4P-L3.7-W3.7-P2.75-LS3.7]  53.94 78.61 90 top
U1  STM32F103C8T6  [LQFP-48_L7.0-W7.0-P0.50-LS9.0-BL]  50 66.86 45 top
U3  -  [SDVX台板框]  50 47.12 0 top
U4  AMS1117-3.3V  [SOT-223-4_L6.5-W3.5-P2.30-LS7.0-TR]  62.98 74.85 180 top
USB1  TYPE-C-16P  [USB-C-SMD_KH-TYPE-C-16P]  50 88.96 180 top
X3  8MHz  [HC-49US_L11.5-W4.5-P4.88]  50 57.15 0 top
X4  32.768kHz  [OSC-SMD_BD2.0-P2.54_TMXLI-206F32.768KHZ12.5PF20PPM]  50.25 49.15 0 top

## Footprints (pads in the part's own frame, mm; a bottom-side part is the same pattern mirrored in y, then rotated)
C0603
  rect 1x1.1 smd: 1(-0.9,0) 2(0.9,0)
DIP-1X4P2.54
  rect 1.7x1.7 hole 1.1: 1(-3.81,0)
  round 1.7 hole 1.1: 2(-1.27,0) 3(1.27,0) 4(3.81,0)
HC-49US_L11.5-W4.5-P4.88
  rect 1.5x1.5 hole 0.9: 1(-2.44,0)
  round 1.5 hole 0.9: 2(2.44,0)
HDR-SMD_16P-P2.54-V-F-R2-C8-LS7.1
  rect 1.02x2.5 smd: 1(-8.89,-3) 2(-8.89,3) 3(-6.35,-3) 4(-6.35,3) 5(-3.81,-3) 6(-3.81,3) 7(-1.27,-3) 8(-1.27,3) 9(1.27,-3) 10(1.27,3) 11(3.81,-3) 12(3.81,3) 13(6.35,-3) 14(6.35,3) 15(8.89,-3) 16(8.89,3)
HDR-TH_20P-P2.54-V
  rect 1.8x1.8 hole 1.2: 1(-24.13,0)
  round 1.8 hole 1.2: 2(-21.59,0) 3(-19.05,0) 4(-16.51,0) 5(-13.97,0) 6(-11.43,0) 7(-8.89,0) 8(-6.35,0) 9(-3.81,0) 10(-1.27,0) 11(1.27,0) 12(3.81,0) 13(6.35,0) 14(8.89,0) 15(11.43,0) 16(13.97,0) 17(16.51,0) 18(19.05,0) 19(21.59,0) 20(24.13,0)
LED0805-RD
  rect 1x1.4 smd: 1(-1.1,0) 2(1.1,0)
LQFP-48_L7.0-W7.0-P0.50-LS9.0-BL
  oval 0.3x1.5 smd: 1(-2.75,-4.25) 2(-2.25,-4.25) 3(-1.75,-4.25) 4(-1.25,-4.25) 5(-0.75,-4.25) 6(-0.25,-4.25) 7(0.25,-4.25) 8(0.75,-4.25) 9(1.25,-4.25) 10(1.75,-4.25) 11(2.25,-4.25) 12(2.75,-4.25) 25(2.75,4.25) 26(2.25,4.25) 27(1.75,4.25) 28(1.25,4.25) 29(0.75,4.25) 30(0.25,4.25) 31(-0.25,4.25) 32(-0.75,4.25) 33(-1.25,4.25) 34(-1.75,4.25) 35(-2.25,4.25) 36(-2.75,4.25)
  oval 1.5x0.3 smd: 13(4.25,-2.75) 14(4.25,-2.25) 15(4.25,-1.75) 16(4.25,-1.25) 17(4.25,-0.75) 18(4.25,-0.25) 19(4.25,0.25) 20(4.25,0.75) 21(4.25,1.25) 22(4.25,1.75) 23(4.25,2.25) 24(4.25,2.75) 37(-4.25,2.75) 38(-4.25,2.25) 39(-4.25,1.75) 40(-4.25,1.25) 41(-4.25,0.75) 42(-4.25,0.25) 43(-4.25,-0.25) 44(-4.25,-0.75) 45(-4.25,-1.25) 46(-4.25,-1.75) 47(-4.25,-2.25) 48(-4.25,-2.75)
OSC-SMD_BD2.0-P2.54_TMXLI-206F32.768KHZ12.5PF20PPM
  rect 2.5x1 smd: 1(3.05,-1.27) 2(3.05,1.27)
  rect 6.2x2.5 smd: 3(-3.05,0)
R0603
  rect 0.806x0.864 smd: 1(-0.753,0) 2(0.753,0)
R0603#2
  rect 1x1.1 smd: 1(-0.8,0) 2(0.8,0)
SOT-223-4_L6.5-W3.5-P2.30-LS7.0-TR
  rect 0.98x2.47 smd: 1(-2.3,-2.835) 2(0,-2.835) 3(2.3,-2.835)
  rect 3.6x2.47 smd: 4(0,2.835)
SW-SMD_4P-L3.7-W3.7-P2.75-LS3.7
  rect 1x0.85 smd: 1(-1.5,1.375) 2(1.5,1.375) 3(-1.5,-1.375) 4(1.5,-1.375)
USB-C-SMD_KH-TYPE-C-16P
  oval 1x2 hole 0.6x1.7: 1(-4.32,1.765) 2(4.32,1.765)
  oval 1x1.8 hole 0.6x1.4: 3(-4.32,-2.415) 4(4.32,-2.415)
  rect 0.3x1.3 smd: A1(-3.35,2.415) A4(-2.55,2.415) A5(-1.25,2.415) A6(-0.25,2.415) A7(0.25,2.415) A8(1.25,2.415) A9(2.55,2.415) A12(3.35,2.415) B1(3.05,2.415) B4(2.25,2.415) B5(1.75,2.415) B6(0.75,2.415) B7(-0.75,2.415) B8(-1.75,2.415) B9(-2.25,2.415) B12(-3.05,2.415)

## Nets
As in the schematic.

Pads without a net: H2 16; SW1 1; SW2 2 3; USB1 A8 B8

## Via types
v1: diameter 0.61, hole 0.305, Top Layer to Bottom Layer, 351 vias
v2: diameter 3.5, hole 3, Top Layer to Bottom Layer, 4 vias

## Routing (per net, layer and track width the routed paths; a pad name or vN(x,y) marks a point on that pad's centre or on a via; arc(x,y) is an arc through that point)
5V: length 174.3
  Top Layer w0.254: C13.2 39.71,47.51 R4.1 ; C13.2 42.25,47.37 P3.3 43.65,46.23 43.65,44.07 44.43,43.29 54.28,43.29 56.46,41.11 59.26,41.11 60.68,42.52 U4.3 60.66,77.71 C12.2 ; C13.2 39.85,37.29 ; 39.85,37.29 39.85,32.83 H2.15 ; 39.85,37.29 41.83,35.31 R18.2
  Bottom Layer w0.254: v1(47.6,86.55) v1(52.4,86.55) 52.62,86.33 52.62,86.31 53,85.92 54.64,85.92 55.37,86.65 58.11,86.65 58.8,85.96 58.8,84.03 v1(60.66,82.17)
  Bottom Layer w0.4: P3.3 43.63,48.75 43.63,82.58 46.94,85.89 47.07,85.89 47.46,86.28 47.46,86.41 v1(47.6,86.55)
GND: length 6.1
  Top Layer w0.254: U1.47 47.84,61.52 47.84,61.47 ; 50.76,70.61 50.76,70.81 U1.23 ; 52.67,65.28 52.67,65.26 U1.8 ; U1.35 44.67,69.02 44.67,69.09 ; R14.2 R15.1
  vias: v1(5.44,91.8) v1(5.44,86.72) v1(5.44,81.64) v1(5.44,76.56) v1(5.44,71.48) v1(5.44,66.4) v1(5.44,61.32) v1(5.44,56.24) v1(5.44,51.16) v1(5.44,46.08) v1(5.44,41) v1(5.44,35.92) v1(5.44,30.84) v1(5.44,25.76) v1(5.44,20.68) v1(5.44,15.6) v1(5.44,10.52) v1(5.44,5.44) v1(10.52,91.8) v1(10.52,86.72) v1(10.52,81.64) v1(10.52,76.56) v1(10.52,71.48) v1(10.52,66.4) v1(10.52,61.32) v1(10.52,56.24) v1(10.52,51.16) v1(10.52,46.08) v1(10.52,41) v1(10.52,35.92) v1(10.52,30.84) v1(10.52,25.76) v1(10.52,20.68) v1(10.52,15.6) v1(10.52,10.52) v1(10.52,5.44) v1(15.6,91.8) v1(15.6,86.72) v1(15.6,81.64) v1(15.6,76.56) v1(15.6,71.48) v1(15.6,66.4) v1(15.6,61.32) v1(15.6,56.24) v1(15.6,51.16) v1(15.6,46.08) v1(15.6,41) v1(15.6,35.92) v1(15.6,30.84) v1(15.6,25.76) v1(15.6,20.68) v1(15.6,15.6) v1(15.6,10.52) v1(15.6,5.44) v1(20.68,91.8) v1(20.68,86.72) v1(20.68,81.64) v1(20.68,71.48) v1(20.68,66.4) v1(20.68,61.32) v1(20.68,56.24) v1(20.68,51.16) v1(20.68,46.08) v1(20.68,41) v1(20.68,35.92) v1(20.68,30.84) v1(20.68,25.76) v1(20.68,20.68) v1(20.68,15.6) v1(20.68,10.52) v1(20.68,5.44) v1(25.76,91.8) v1(25.76,86.72) v1(25.76,81.64) v1(25.76,76.56) v1(25.76,71.48) v1(25.76,66.4) v1(25.76,61.32) v1(25.76,56.24) v1(25.76,51.16) v1(25.76,46.08) v1(25.76,41) v1(25.76,35.92) v1(25.76,30.84) v1(25.76,25.76) v1(25.76,20.68) v1(25.76,15.6) v1(25.76,10.52) v1(25.76,5.44) v1(30.84,91.8) v1(30.84,86.72) v1(30.84,81.64) v1(30.84,76.56) v1(30.84,71.48) v1(30.84,66.4) v1(30.84,61.32) v1(30.84,56.24) v1(30.84,51.16) v1(30.84,46.08) v1(30.84,41) v1(30.84,35.92) v1(30.84,30.84) v1(30.84,25.76) v1(30.84,20.68) v1(30.84,15.6) v1(30.84,10.52) v1(30.84,5.44) v1(35.92,91.8) v1(35.92,66.4) v1(35.92,61.32) v1(35.92,56.24) v1(35.92,51.16) v1(35.92,46.08) v1(35.92,41) v1(35.92,35.92) v1(35.92,30.84) v1(35.92,25.76) v1(35.92,20.68) v1(35.92,15.6) v1(35.92,10.52) v1(35.92,5.44) v1(40.22,88.27) v1(40.2,85.07) v1(40.2,82.15) v1(40.22,79.76) v1(40.22,77.64) v1(40.22,75.06) v1(40.51,71.82) v1(40.6,66.17) v1(40.6,62.36) v1(41,20.68) v1(41,15.6) v1(41,10.52) v1(41,5.44) v1(44.54,81.92) v1(44.48,66.86) v1(45.28,51.62) v1(45.3,29.09) v1(46.08,20.68) v1(46.08,15.6) v1(46.08,10.52) v1(46.08,5.44) v1(46.32,37.34) v1(46.8,86.55) v1(47.2,49.15) v1(47.3,65.26) v1(47.36,45.94) v1(48.35,87.76) v1(48.6,69.72) v1(49.24,73.53) v1(50,84.33) v1(50,65.97) v1(50,49.15) v1(50.26,37.34) v1(50.37,29.09) v1(50.89,70.1) v1(51.16,91.8) v1(51.16,20.68) v1(51.16,15.6) v1(51.16,10.52) v1(51.16,5.44) v1(51.81,51.95) v1(51.81,49.15) v1(51.91,55) v1(51.91,46.23) v1(52.29,67.18) v1(52.98,59.17) v1(53.2,86.55) v1(54.95,75.69) v1(55.62,29.09) v1(56.24,91.8) v1(56.24,71.48) v1(56.24,20.68) v1(56.24,15.6) v1(56.24,10.52) v1(56.24,5.44) v1(56.99,37.34) v1(61.32,91.8) v1(61.32,86.72) v1(61.32,35.92) v1(61.32,30.84) v1(61.32,25.76) v1(61.32,20.68) v1(61.32,15.6) v1(61.32,10.52) v1(61.32,5.44) v1(61.43,66.42) v1(61.43,61.34) v1(61.43,56.26) v1(61.43,51.18) v1(61.43,46.1) v1(66.4,91.8) v1(66.4,86.72) v1(66.4,81.64) v1(66.4,71.48) v1(66.4,66.4) v1(66.4,61.32) v1(66.4,56.24) v1(66.4,51.16) v1(66.4,46.08) v1(66.4,41) v1(66.4,35.92) v1(66.4,30.84) v1(66.4,25.76) v1(66.4,20.68) v1(66.4,15.6) v1(66.4,10.52) v1(66.4,5.44) v1(71.48,91.8) v1(71.48,86.72) v1(71.48,81.64) v1(71.48,76.56) v1(71.48,71.48) v1(71.48,66.4) v1(71.48,61.32) v1(71.48,56.24) v1(71.48,51.16) v1(71.48,46.08) v1(71.48,41) v1(71.48,35.92) v1(71.48,30.84) v1(71.48,25.76) v1(71.48,20.68) v1(71.48,15.6) v1(71.48,10.52) v1(71.48,5.44) v1(76.56,91.8) v1(76.56,86.72) v1(76.56,81.64) v1(76.56,76.56) v1(76.56,71.48) v1(76.56,66.4) v1(76.56,61.32) v1(76.56,56.24) v1(76.56,51.16) v1(76.56,46.08) v1(76.56,41) v1(76.56,35.92) v1(76.56,30.84) v1(76.56,25.76) v1(76.56,20.68) v1(76.56,15.6) v1(76.56,10.52) v1(76.56,5.44) v1(81.64,91.8) v1(81.64,86.72) v1(81.64,81.64) v1(81.64,71.48) v1(81.64,66.4) v1(81.64,61.32) v1(81.64,56.24) v1(81.64,51.16) v1(81.64,46.08) v1(81.64,41) v1(81.64,35.92) v1(81.64,30.84) v1(81.64,25.76) v1(81.64,20.68) v1(81.64,15.6) v1(81.64,10.52) v1(81.64,5.44) v1(86.72,91.8) v1(86.72,86.72) v1(86.72,81.64) v1(86.72,76.56) v1(86.72,71.48) v1(86.72,66.4) v1(86.72,61.32) v1(86.72,56.24) v1(86.72,51.16) v1(86.72,46.08) v1(86.72,41) v1(86.72,35.92) v1(86.72,30.84) v1(86.72,25.76) v1(86.72,20.68) v1(86.72,15.6) v1(86.72,10.52) v1(86.72,5.44) v1(91.8,91.8) v1(91.8,86.72) v1(91.8,81.64) v1(91.8,76.56) v1(91.8,71.48) v1(91.8,66.4) v1(91.8,61.32) v1(91.8,56.24) v1(91.8,51.16) v1(91.8,46.08) v1(91.8,41) v1(91.8,35.92) v1(91.8,30.84) v1(91.8,25.76) v1(91.8,20.68) v1(91.8,15.6) v1(91.8,10.52) v1(91.8,5.44) v1(96.88,91.8) v1(96.88,86.72) v1(96.88,81.64) v1(96.88,76.56) v1(96.88,71.48) v1(96.88,66.4) v1(96.88,61.32) v1(96.88,56.24) v1(96.88,51.16) v1(96.88,46.08) v1(96.88,41) v1(96.88,35.92) v1(96.88,30.84) v1(96.88,25.76) v1(96.88,20.68) v1(96.88,15.6) v1(96.88,10.52) v1(96.88,5.44) v2(3,2.86) v2(20,76.86) v2(80,76.86) v2(97,2.86)
VBAT: length 22.3
  Top Layer w0.254: P2.1 55.62,44.29 55.62,50.19 55.21,50.6 55.21,51.2 55.21,51.21 55.21,52.15 54.76,52.6 54.76,54.42 54.34,54.84 54.34,56.7 54,57.04 54,58.97 U1.1
VCC3.3: length 153.2
  Top Layer w0.2: 49.41,62.26 49.07,61.91 U1.48 ; 49.41,62.26 49.41,69.71 ; 49.41,62.26 49.45,62.3 ; v1(49.62,70.1) 49.56,70.1 49.41,69.96 49.41,69.74 46.72,67.05 v1(46.25,67.05)
  Top Layer w0.254: 54.39,61.63 54.39,64.24 53.89,64.74 ; v1(46.95,77.31) 48.5,78.86 SW1.2 ; P2.18 C6.2 ; v1(46.25,67.05) 45.92,67.05 U1.36 ; P3.1 42.25,42.29 v1(42.25,40.02) 42.63,39.64 v1(53.81,39.64) 53.81,42.04 ; U1.24 52.02,72.77 v1(52.23,72.77) ; v1(50.3,44.7) LED1.1
  Top Layer w0.4: U4.2 U4.4 62.98,70.42 C11.2 C10.2 62.2,42.56 59.77,40.12 55.72,40.12 53.81,42.04 H1.4
  Bottom Layer w0.254: 53.81,61.06 53.83,61.06 v1(54.39,61.62) ; v1(50.3,44.7) 51.27,44.7 H1.4 ; 53.81,76.27 52.77,77.31 v1(46.95,77.31) ; 53.81,71.34 53.65,71.34 v1(52.23,72.77) 52.23,72.71 v1(49.62,70.1)
  Bottom Layer w0.4: P2.18 57.62,85.47 53.81,81.66 H1.4
BOOT0: length 23.6
  Top Layer w0.254: C14.1 50.9,81.02 51.25,80.67 v1(51.25,80.11) ; U1.44 48.83,64.64 v1(48.83,68.34)
  Bottom Layer w0.254: v1(48.83,68.34) 46.24,70.93 46.24,77.52 46.61,77.89 49.03,77.89 v1(51.25,80.11)
BOOT1: length 20
  Top Layer w0.2: U1.20 v1(51.55,69.47)
  Top Layer w0.254: R6.2 R16.1
  Bottom Layer w0.254: v1(51.55,69.47) 49.77,67.69 48.35,67.69 45.83,70.21 45.83,77.69 46.44,78.3 46.78,78.3 46.95,78.47 v1(46.95,78.87)
OSCIN: length 14.8
  Top Layer w0.2: U1.5 51.13,64.67 50.46,64.67 50.21,64.42 50.21,61.17 R1.2
  Top Layer w0.254: R1.2 52.44,58.94 X3.2 52.44,55.75 52.81,55.39 C4.1
OSCOUT: length 15.8
  Top Layer w0.2: U1.6 51.49,65.02 50.31,65.02 49.8,64.51 49.8,61.18 R1.1
  Top Layer w0.254: R1.1 47.56,58.94 X3.1 47.59,57.12 47.59,55.75 47.21,55.37 47.21,53.61 C3.1
PA0: length 13.9
  Top Layer w0.254: 57.21,52.45 57.21,52.86 56.4,53.67 56.4,55.23 55.97,55.66 55.97,57.61 55.63,57.95 55.63,61.21 54.81,62.02 54.81,64.52 U1.10
PA1: length 11.5
  Top Layer w0.254: U1.11 55.22,64.82 55.22,62.19 56.03,61.38 56.03,58.14 56.37,57.8 56.37,56.19 57.21,55.35 57.21,54.99
PA2: length 9.2
  Top Layer w0.254: U1.12 55.63,65.12 55.63,62.36 56.44,61.55 56.44,58.71 57.21,57.94 57.21,57.53
PA3: length 9
  Top Layer w0.254: P2.8 57.62,60.94 56.03,62.53 56.03,65.53 55.63,65.93 55.63,67.25 U1.13
PA4: length 8.7
  Top Layer w0.254: P2.9 56.44,63.79 56.44,65.7 56.03,66.1 56.03,68.82 55.84,69.01 55.33,69.01 U1.14
PA5: length 7.1
  Top Layer w0.254: U1.15 55.03,69.42 56.19,69.42 56.44,69.17 56.44,66.33 P2.10
PA6: length 56.3
  Top Layer w0.254: 53.89,68.98 54.73,69.82 56.36,69.82 57.62,68.56 P2.11
  Bottom Layer w0.254: P2.11 58.8,66.51 58.8,30.02 56.78,27.99 49.92,27.99 48.73,26.8 v1(48.73,25.57)
PA7: length 55.9
  Top Layer w0.254: P2.12 54.43,70.23 U1.17
  Bottom Layer w0.254: v1(51.27,25.57) 51.38,25.69 51.38,26.8 52.16,27.58 56.94,27.58 59.21,29.85 59.21,68.64 P2.12
PA8: length 64.9
  Top Layer w0.254: U1.29 44.37,73.55 44.37,78.53 P3.16
  Bottom Layer w0.254: P3.16 42.12,80.52 38.75,77.15 38.75,36.39 43.56,31.58 v1(43.65,31.58)
PA9: length 60.8
  Top Layer w0.254: P3.15 43.97,76.39 43.97,73.25 U1.30
  Bottom Layer w0.254: P3.15 42,77.98 39.15,75.13 39.15,38.59 46.17,31.58 v1(46.19,31.58)
PA10: length 57.7
  Top Layer w0.254: U1.31 43.56,72.95 43.56,74.26 P3.14
  Bottom Layer w0.254: v1(48.73,31.58) 47.16,33.15 45.17,33.15 39.56,38.76 39.56,72.8 42.2,75.44 P3.14
PA11: length 10.1
  Top Layer w0.254: U1.32 42.9,72.9 P3.13 R2.2
PA12: length 8.9
  Top Layer w0.254: 46.11,68.98 44.74,70.36 P3.12 42.29,70.27 R4.2 39.68,70.23 R3.2
PA13: length 28.7
  Top Layer w0.254: U1.34 46.26,68.13 ; 46.26,68.13 v1(46.63,67.75)
  Bottom Layer w0.254: v1(46.63,67.75) 49.14,65.25 49.14,44.3 H1.3
PA14: length 27.1
  Top Layer w0.254: v1(47.08,66.29) 46.01,66.29 46.01,66.3 45.65,66.3 45.64,66.29 45.54,66.29 U1.37
  Bottom Layer w0.254: v1(47.08,66.29) 47.53,65.84 47.55,65.84 47.89,65.5 47.89,65.48 48.73,64.64 H1.2
PA15: length 4.9
  Top Layer w0.254: U1.38 44.9,64.95 44.45,64.95 42.38,67.02 P3.11
PB0: length 57.8
  Top Layer w0.254: P2.13 56.26,72.77 U1.18
  Bottom Layer w0.254: P2.13 59.61,70.78 59.61,29.68 57.11,27.18 54.19,27.18 53.81,26.8 v1(53.81,25.57)
PB1: length 59.7
  Top Layer w0.254: P2.14 57.86,75.07 U1.19
  Bottom Layer w0.254: v1(56.35,25.57) 60.02,29.24 60.02,72.91 P2.14
PB3: length 3.9
  Top Layer w0.254: U1.39 45.2,64.54 43.12,64.54 P3.10
PB4: length 43.7
  Top Layer w0.254: 46.11,64.74 44.11,62.74 P3.9
  Bottom Layer w0.254: v1(51.27,31.58) 49.29,33.55 45.34,33.55 39.97,38.92 39.97,60.33 P3.9
PB5: length 44.4
  Top Layer w0.254: U1.41 43.52,61.45 43.52,61.35 42.38,60.2 P3.8
  Bottom Layer w0.254: P3.8 40.37,58.19 40.37,39.09 45.51,33.96 51.43,33.96 v1(53.81,31.58)
PB6: length 46
  Top Layer w0.254: P3.7 43.56,58.84 43.56,60.78 U1.42
  Bottom Layer w0.254: v1(56.35,31.58) 53.56,34.37 45.67,34.37 40.78,39.26 40.78,56.06 P3.7
PB7: length 10.5
  Top Layer w0.254: P3.6 43.97,56.7 43.97,60.48 U1.43
PB8: length 12.7
  Top Layer w0.254: P3.5 43.56,53.76 43.56,55.72 44.37,56.54 44.37,59.47 47.88,62.97
PB9: length 47.6
  Top Layer w0.254: H2.1 58.89,32.64 v1(56.22,35.31) ; U1.46 44.78,59.17 44.78,56.37 43.97,55.55 43.97,53.59 43.56,53.18 43.56,51.22 P3.4
  Bottom Layer w0.254: P3.4 42.38,49.16 41.19,47.97 41.19,39.55 45.43,35.31 v1(56.22,35.31)
PB10: length 9.4
  Top Layer w0.254: P2.15 57.62,77.13 56.44,75.95 56.44,75.07 52.12,70.75
PB11: length 11.7
  Top Layer w0.254: U1.22 56.02,75.35 56.02,76.25 56.44,76.67 56.44,79.21 P2.16
PB12: length 21.2
  Top Layer w0.254: 48.69,72.05 46,74.74 46,85.28 43.56,87.72 43.56,89.5 P3.20
PB13: length 19.2
  Top Layer w0.254: P3.19 45.59,84.93 45.59,74.45 U1.26
PB14: length 81.1
  Top Layer w0.254: P3.18 45.19,82.79 45.19,74.16 48.23,71.11 U1.27
  Bottom Layer w0.254: v1(43.65,25.57) 37.94,31.29 37.94,81.15 P3.18
PB15: length 77
  Top Layer w0.254: 47.88,70.75 44.78,73.85 44.78,80.66 P3.17
  Bottom Layer w0.254: P3.17 38.34,79.02 38.34,33.42 v1(46.19,25.57)
PC13: length 23.8
  Top Layer w0.254: P2.2 56.02,46.43 56.02,49.6 56.03,49.61 56.03,50.35 55.62,50.76 55.62,52.32 55.18,52.76 55.18,54.58 54.75,55.01 54.75,56.9 54.41,57.24 54.41,59.27 U1.2
  Bottom Layer w0.2: P2.2 56.19,46.27 v1(54.47,46.27)
PC14: length 39.2
  Top Layer w0.2: v1(50.89,63.3) 51.09,63.3 U1.3
  Top Layer w0.254: U1.3 54.81,59.57 54.81,57.41 55.16,57.06 55.16,55.18 55.59,54.75 55.59,52.93 56.02,52.49 56.02,50.93 56.44,50.52 56.44,49.44 56.43,49.43 56.43,48.56 P2.3 ; X4.1 51.91,47.88 50.89,46.86 v1(50.14,46.86)
  Bottom Layer w0.2: v1(50.89,63.3) 50.7,63.1 50.7,47.42 v1(50.14,46.86)
PC15: length 33.5
  Top Layer w0.2: v1(50.83,64.11) 50.98,64.11 52.12,62.97
  Top Layer w0.254: v1(50.14,51.44) 50.89,51.44 51.91,50.42 X4.2 ; 52.12,62.97 55.22,59.87 55.22,57.69 55.56,57.35 55.56,55.47 55.99,55.04 55.99,53.1 56.43,52.66 56.43,51.1 57.21,50.32 57.21,49.91
  Bottom Layer w0.2: v1(50.14,51.44) 50.14,63.42 v1(50.83,64.11)
  vias: v1(53.15,62.23)
RESET: length 26.3
  Top Layer w0.2: P2.17 55.99,81.3 55.99,78.63 55.36,78 52.76,78 52.56,77.8 SW2.1
  Top Layer w0.254: 52.76,74.64 52.76,74.64 50.21,72.09 50.21,67.01 U1.7 ; 52.76,74.64 C5.2 52.56,75.9 SW2.1 ; 52.76,74.64 53.36,74.04 R5.1
USB_DM: length 36.1
  Top Layer w0.254: R2.1 36.25,73.48 36.62,73.85 36.62,88.85 40.03,92.26 43.29,92.26 46.67,88.89 49.51,88.89 50.25,88.14 50.25,87.48 ; 50.25,87.48 50.52,87.48 50.75,87.24 USB1.B7 ; 50.25,87.48 49.98,87.48 49.75,87.25 USB1.A7
USB_DP: length 37.9
  Top Layer w0.254: USB1.A6 50.25,85.85 50.02,85.62 49.48,85.62 49.25,85.85 USB1.B6 49.25,88 48.89,88.36 46.62,88.36 43.12,91.86 40.2,91.86 37.03,88.69 37.03,71.86 36.25,71.08 R3.1
$3N30531: length 2.4
  Top Layer w0.254: R8.1 46.48,46.01 45.98,45.51 LED1.2
$3N30532: length 2
  Top Layer w0.254: LED2.2 54.41,44.7 R9.1
$3N30903: length 7.8
  Top Layer w0.254: R14.1 49.5,82.92 48.25,84.17 USB1.B5
$3N30904: length 6.5
  Top Layer w0.254: USB1.A5 51.25,84.03 51.68,83.61 54.19,83.61 54.7,83.1 R15.2
$3N31755: length 3.9
  Top Layer w0.254: R17.1 50.38,75.44 51.25,76.3 SW1.3

## Copper pours and planes (outline as drawn; the poured copper is in the pictures)
GND on Top Layer: -16.42,107.06 111.47,107.06 111.47,-4.19 -16.42,-4.19
GND on Bottom Layer: -5.88,97.66 106.77,97.66 106.77,-5.46 -5.88,-5.46

## Text on the board
Top Silkscreen Layer: JLCJLCJLCJLC

# Board Position_Board
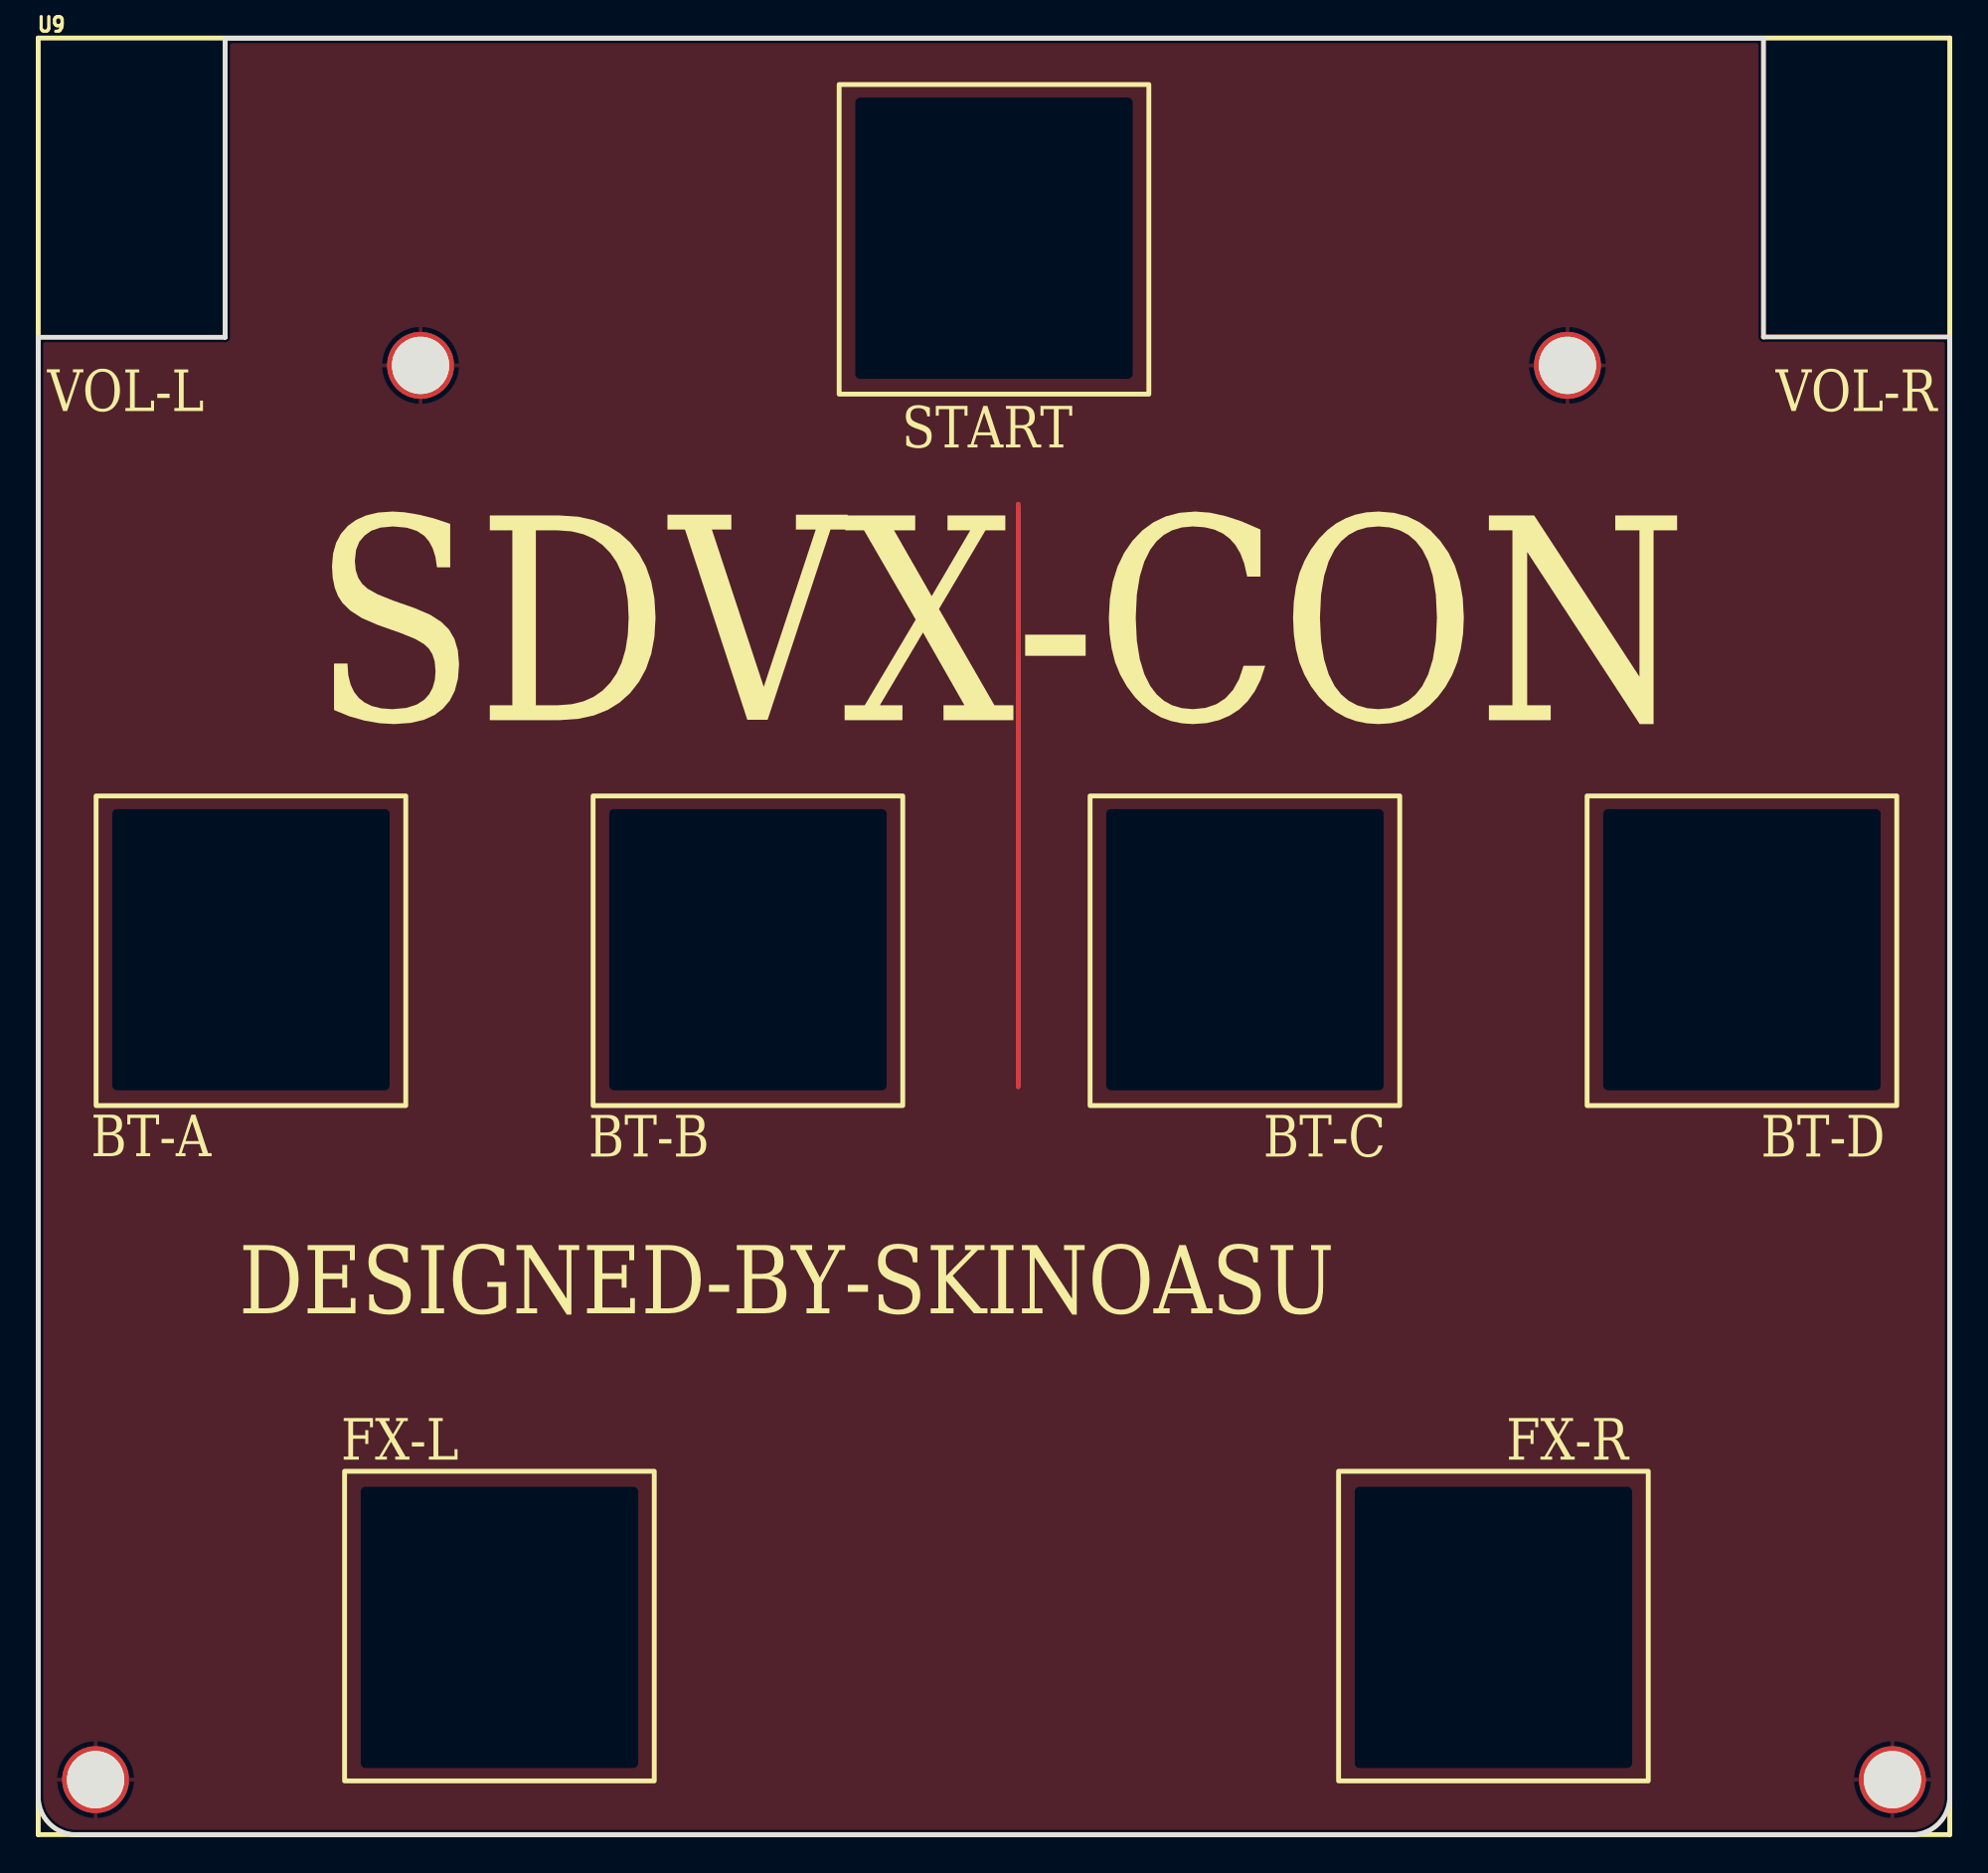
[diagram p5: board, top side]
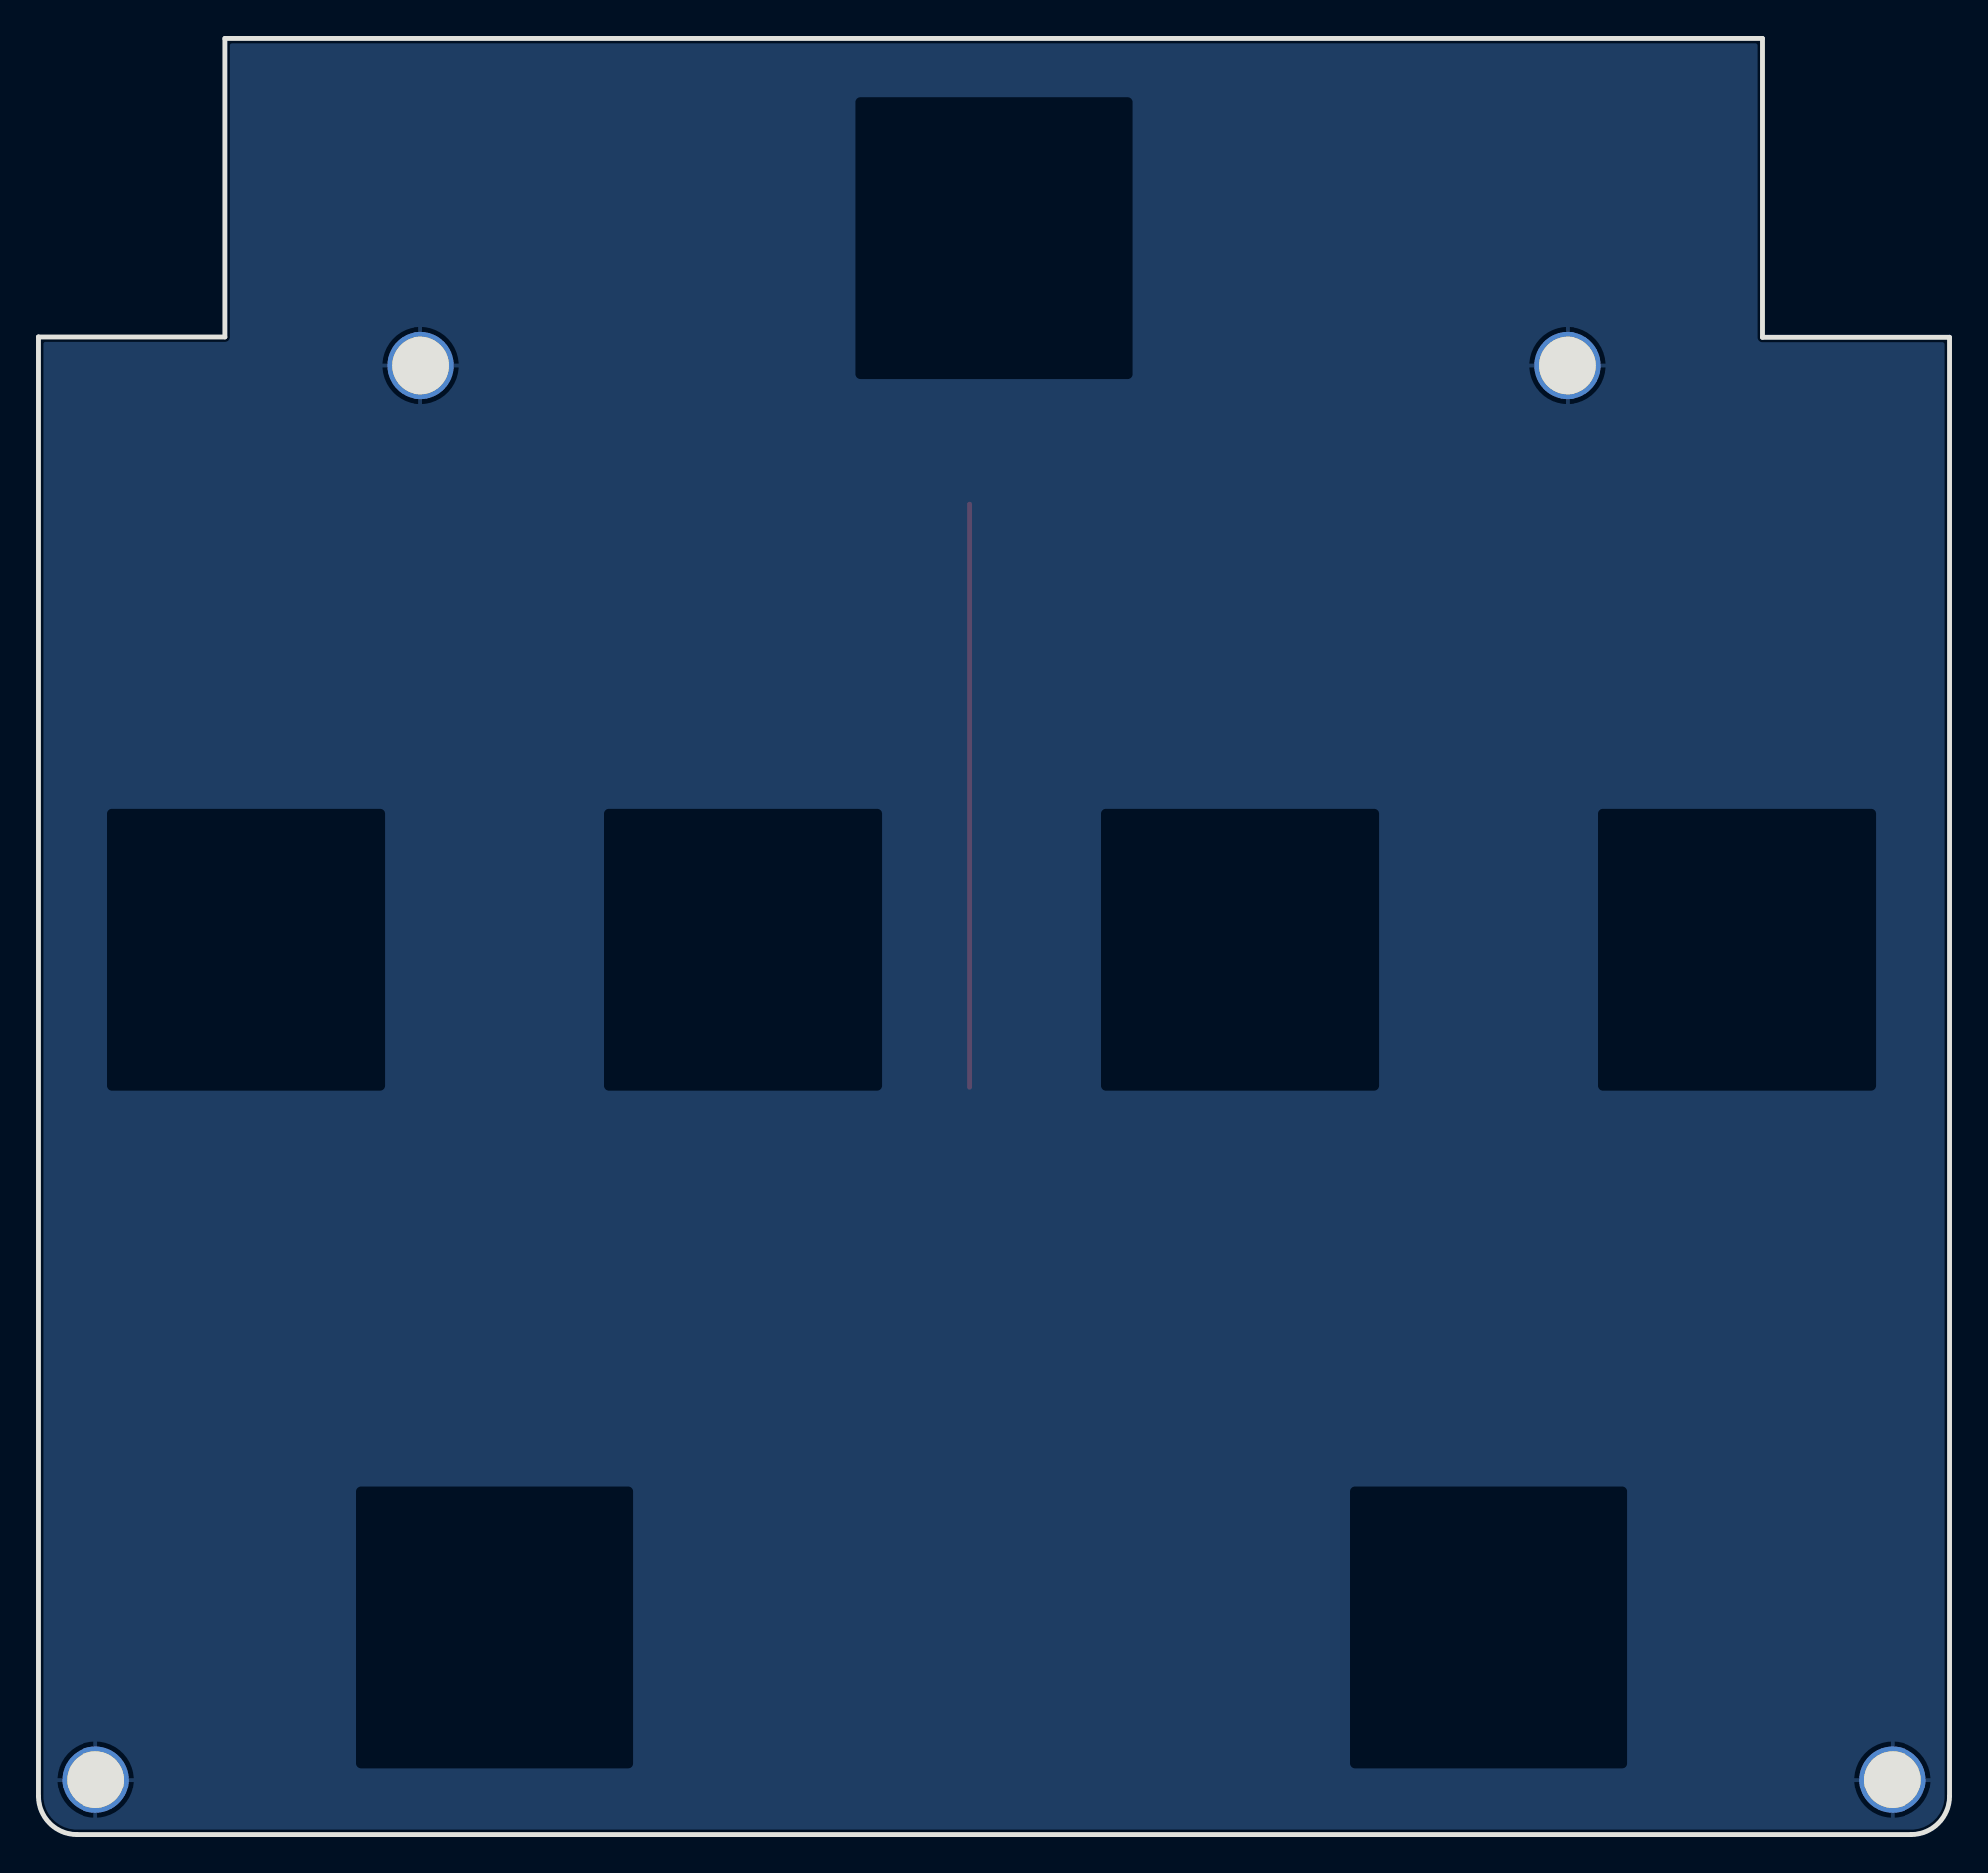
[diagram p6: board, bottom side, seen from below]

Outline 100 x 94 mm; copper layers: Top Layer, Bottom Layer. Coordinates in mm from the lower left corner of the outline.
Outline path: 0,78.35 0,2 arc(0.59,0.59) 2,0 98,0 arc(99.41,0.59) 100,2 100,78.37 90.25,78.37 90.25,94 9.78,94 9.78,78.35 0,78.35
Stack: Top Layer 0.035mm / Dielectric1 1.51mm FR4 er 4.5 / Bottom Layer 0.035mm

## Design rules (mm)
spacing safeClearance (default): track to track 0.152, other pairs 0.152 to 0.3
track width trackWidth (default): min 0.127, default 0.254, max 2.54
track width trackWidth1: min 0.127, default 0.508, max 2.54
differential pair differentialPair (default): width min 0.127, default 0.254, max 2.54; gap min 0.152, default 0.152
via viaSize (default): diameter min 0.5, default 0.61, max 10; hole min 0.3, default 0.305, max 6

## Placement (name value [footprint] x y rotation side)
NOREF  -  [Pad_e3496]  97 2.88 0 top
NOREF#2  -  [Pad_e3634]  80 76.88 0 top
NOREF#3  -  [Pad_e3635]  20 76.88 0 top
NOREF#4  -  [Pad_e3498]  3 2.88 0 top
U9  -  [SDVX台板框]  50 47.01 0 top

## Footprints (pads in the part's own frame, mm; a bottom-side part is the same pattern mirrored in y, then rotated)
Pad_e3496
  round 3.5 hole 3: 1(0,0)
Pad_e3498
  round 3.5 hole 3: 1(0,0)
Pad_e3634
  round 3.5 hole 3: 1(0,0)
Pad_e3635
  round 3.5 hole 3: 1(0,0)

## Nets
GND: NOREF.1 NOREF#2.1 NOREF#3.1 NOREF#4.1

## Routing (per net, layer and track width the routed paths; a pad name or vN(x,y) marks a point on that pad's centre or on a via; arc(x,y) is an arc through that point)
GND: length 30.5
  Top Layer w0.254: 51.27,39.14 51.27,69.62

## Copper pours and planes (outline as drawn; the poured copper is in the pictures)
GND on Top Layer: -6.9,99.33 105.25,99.33 105.25,-6.2 -6.9,-6.2
GND on Bottom Layer: -14.39,105.68 109.94,105.68 109.94,-13.95 -14.39,-13.95

## Text on the board
Top Silkscreen Layer: DESIGNED-BY-SKINOASU | VOL-L | BT-A | FX-L | BT-B | START | BT-C | FX-R | BT-D | VOL-R | SDVX-CON

# Board Key_Board
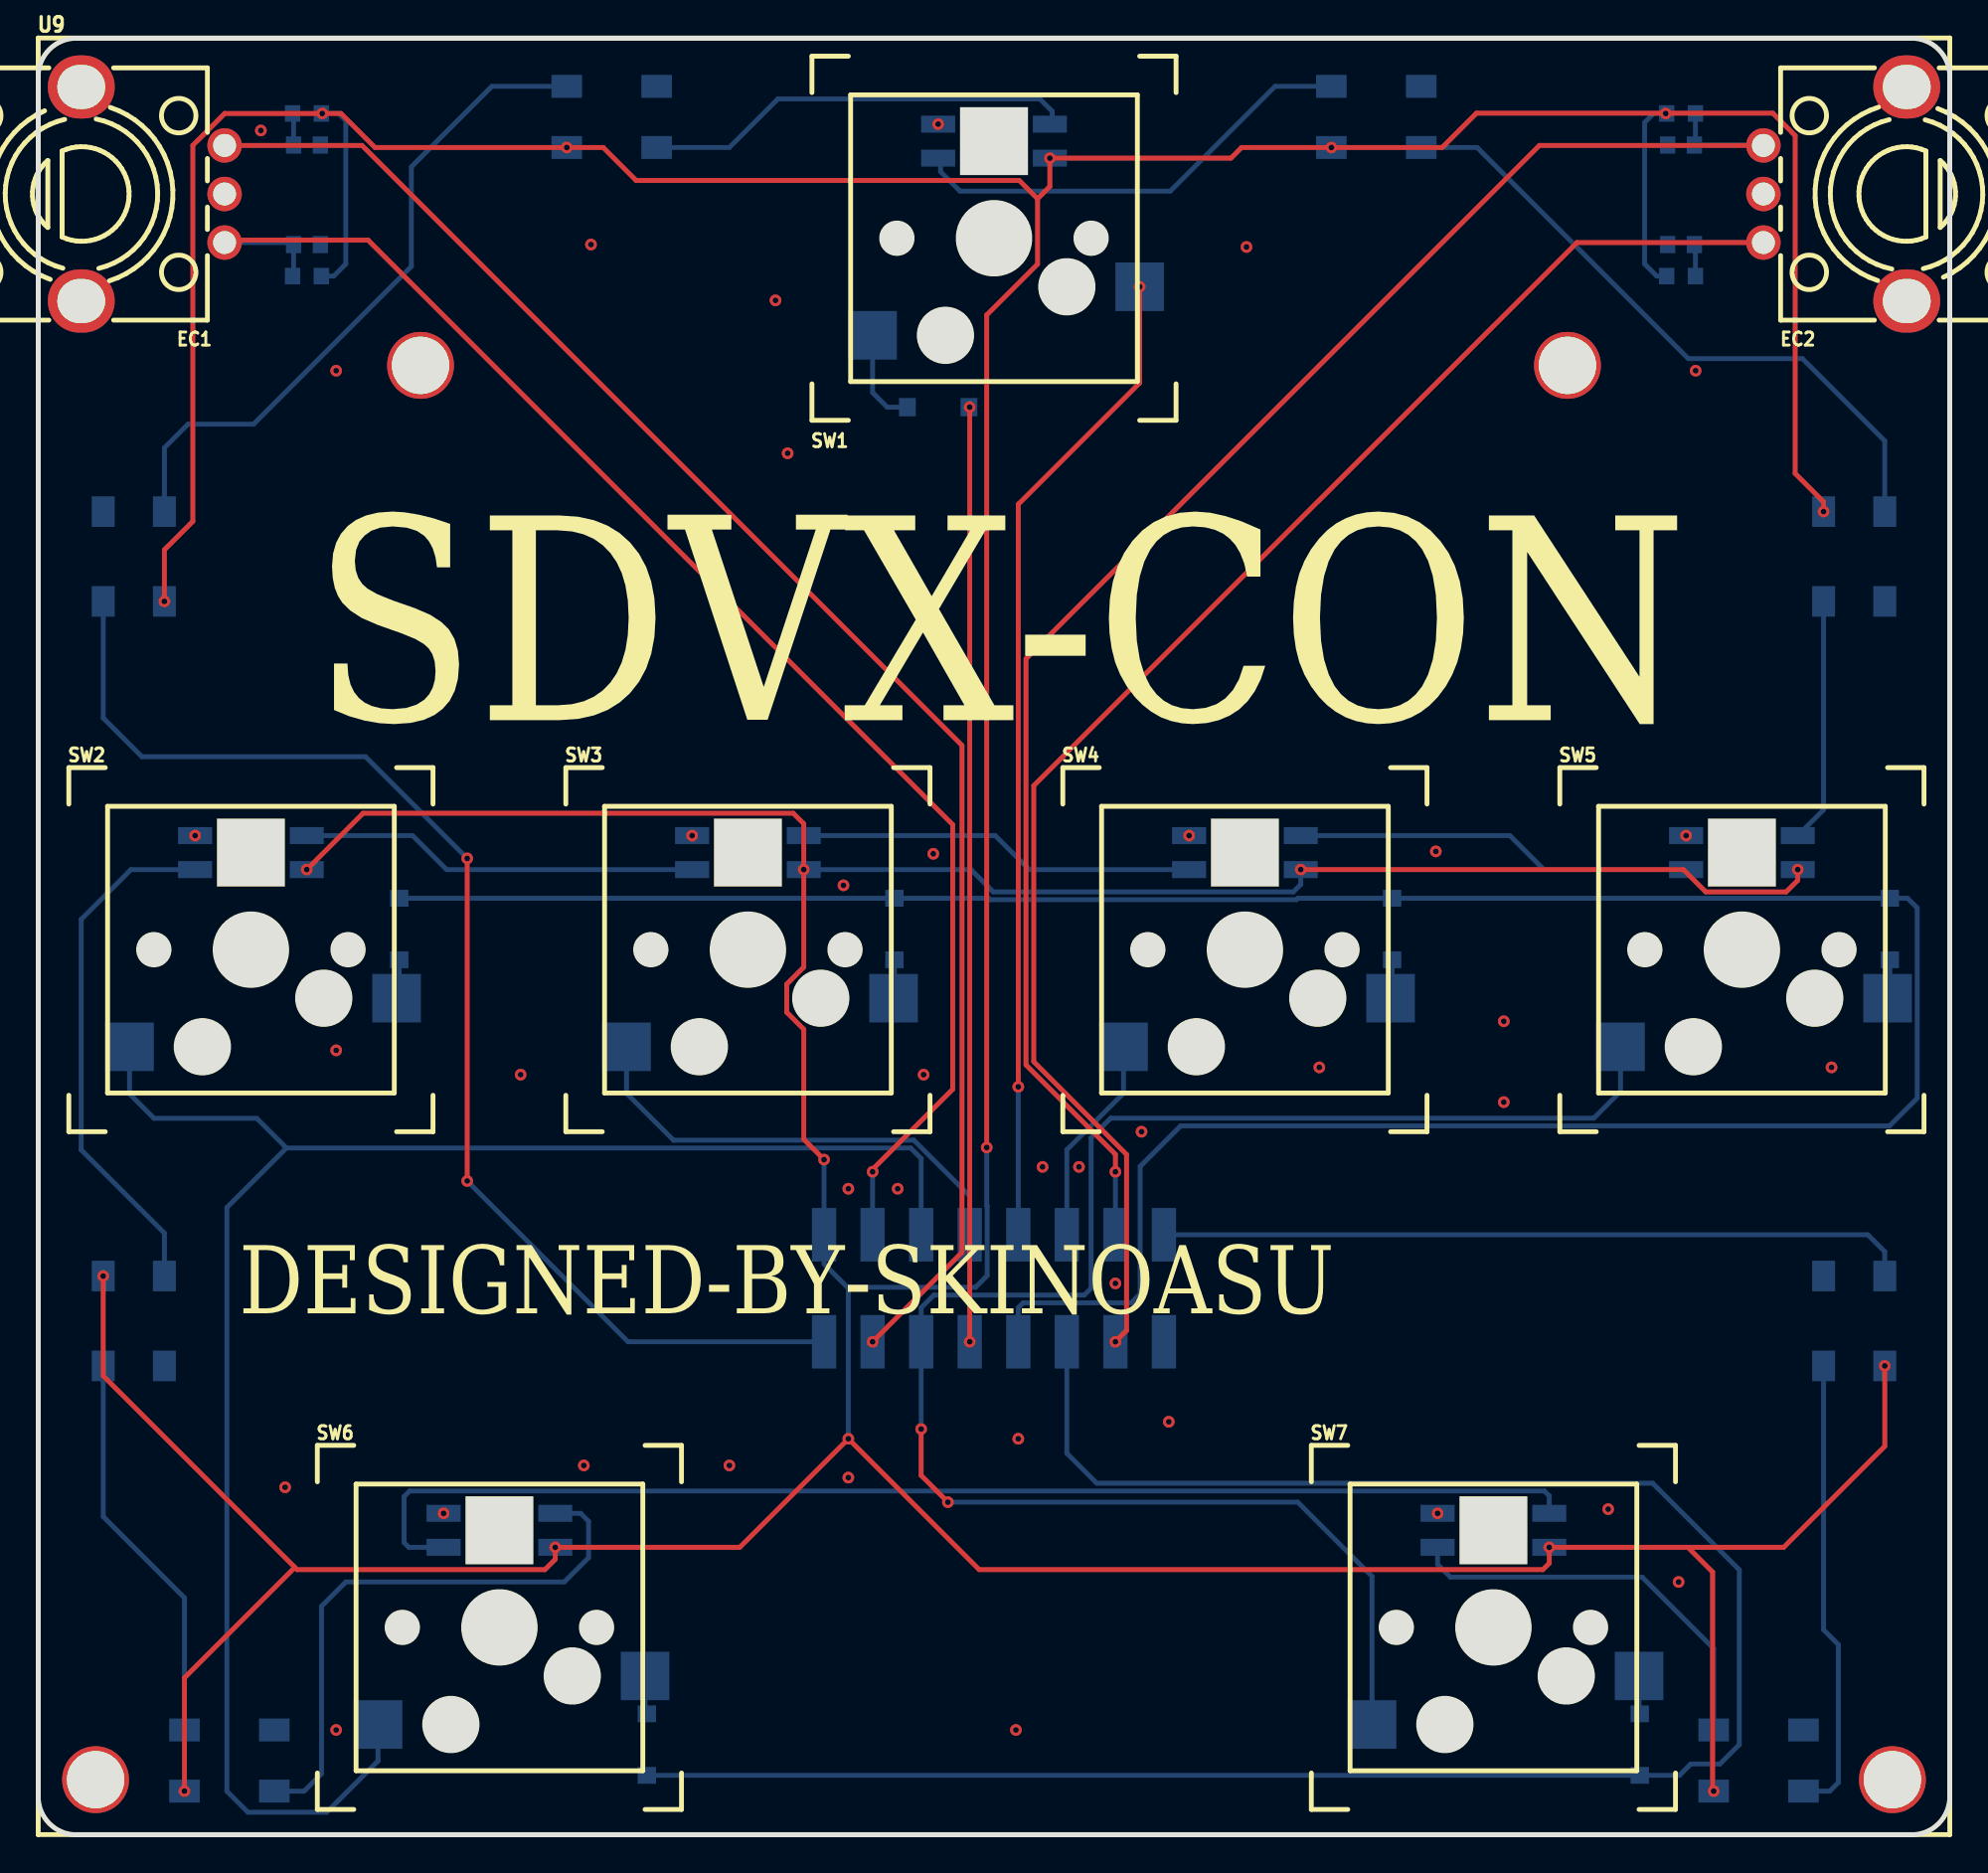
[diagram p7: board, top side]
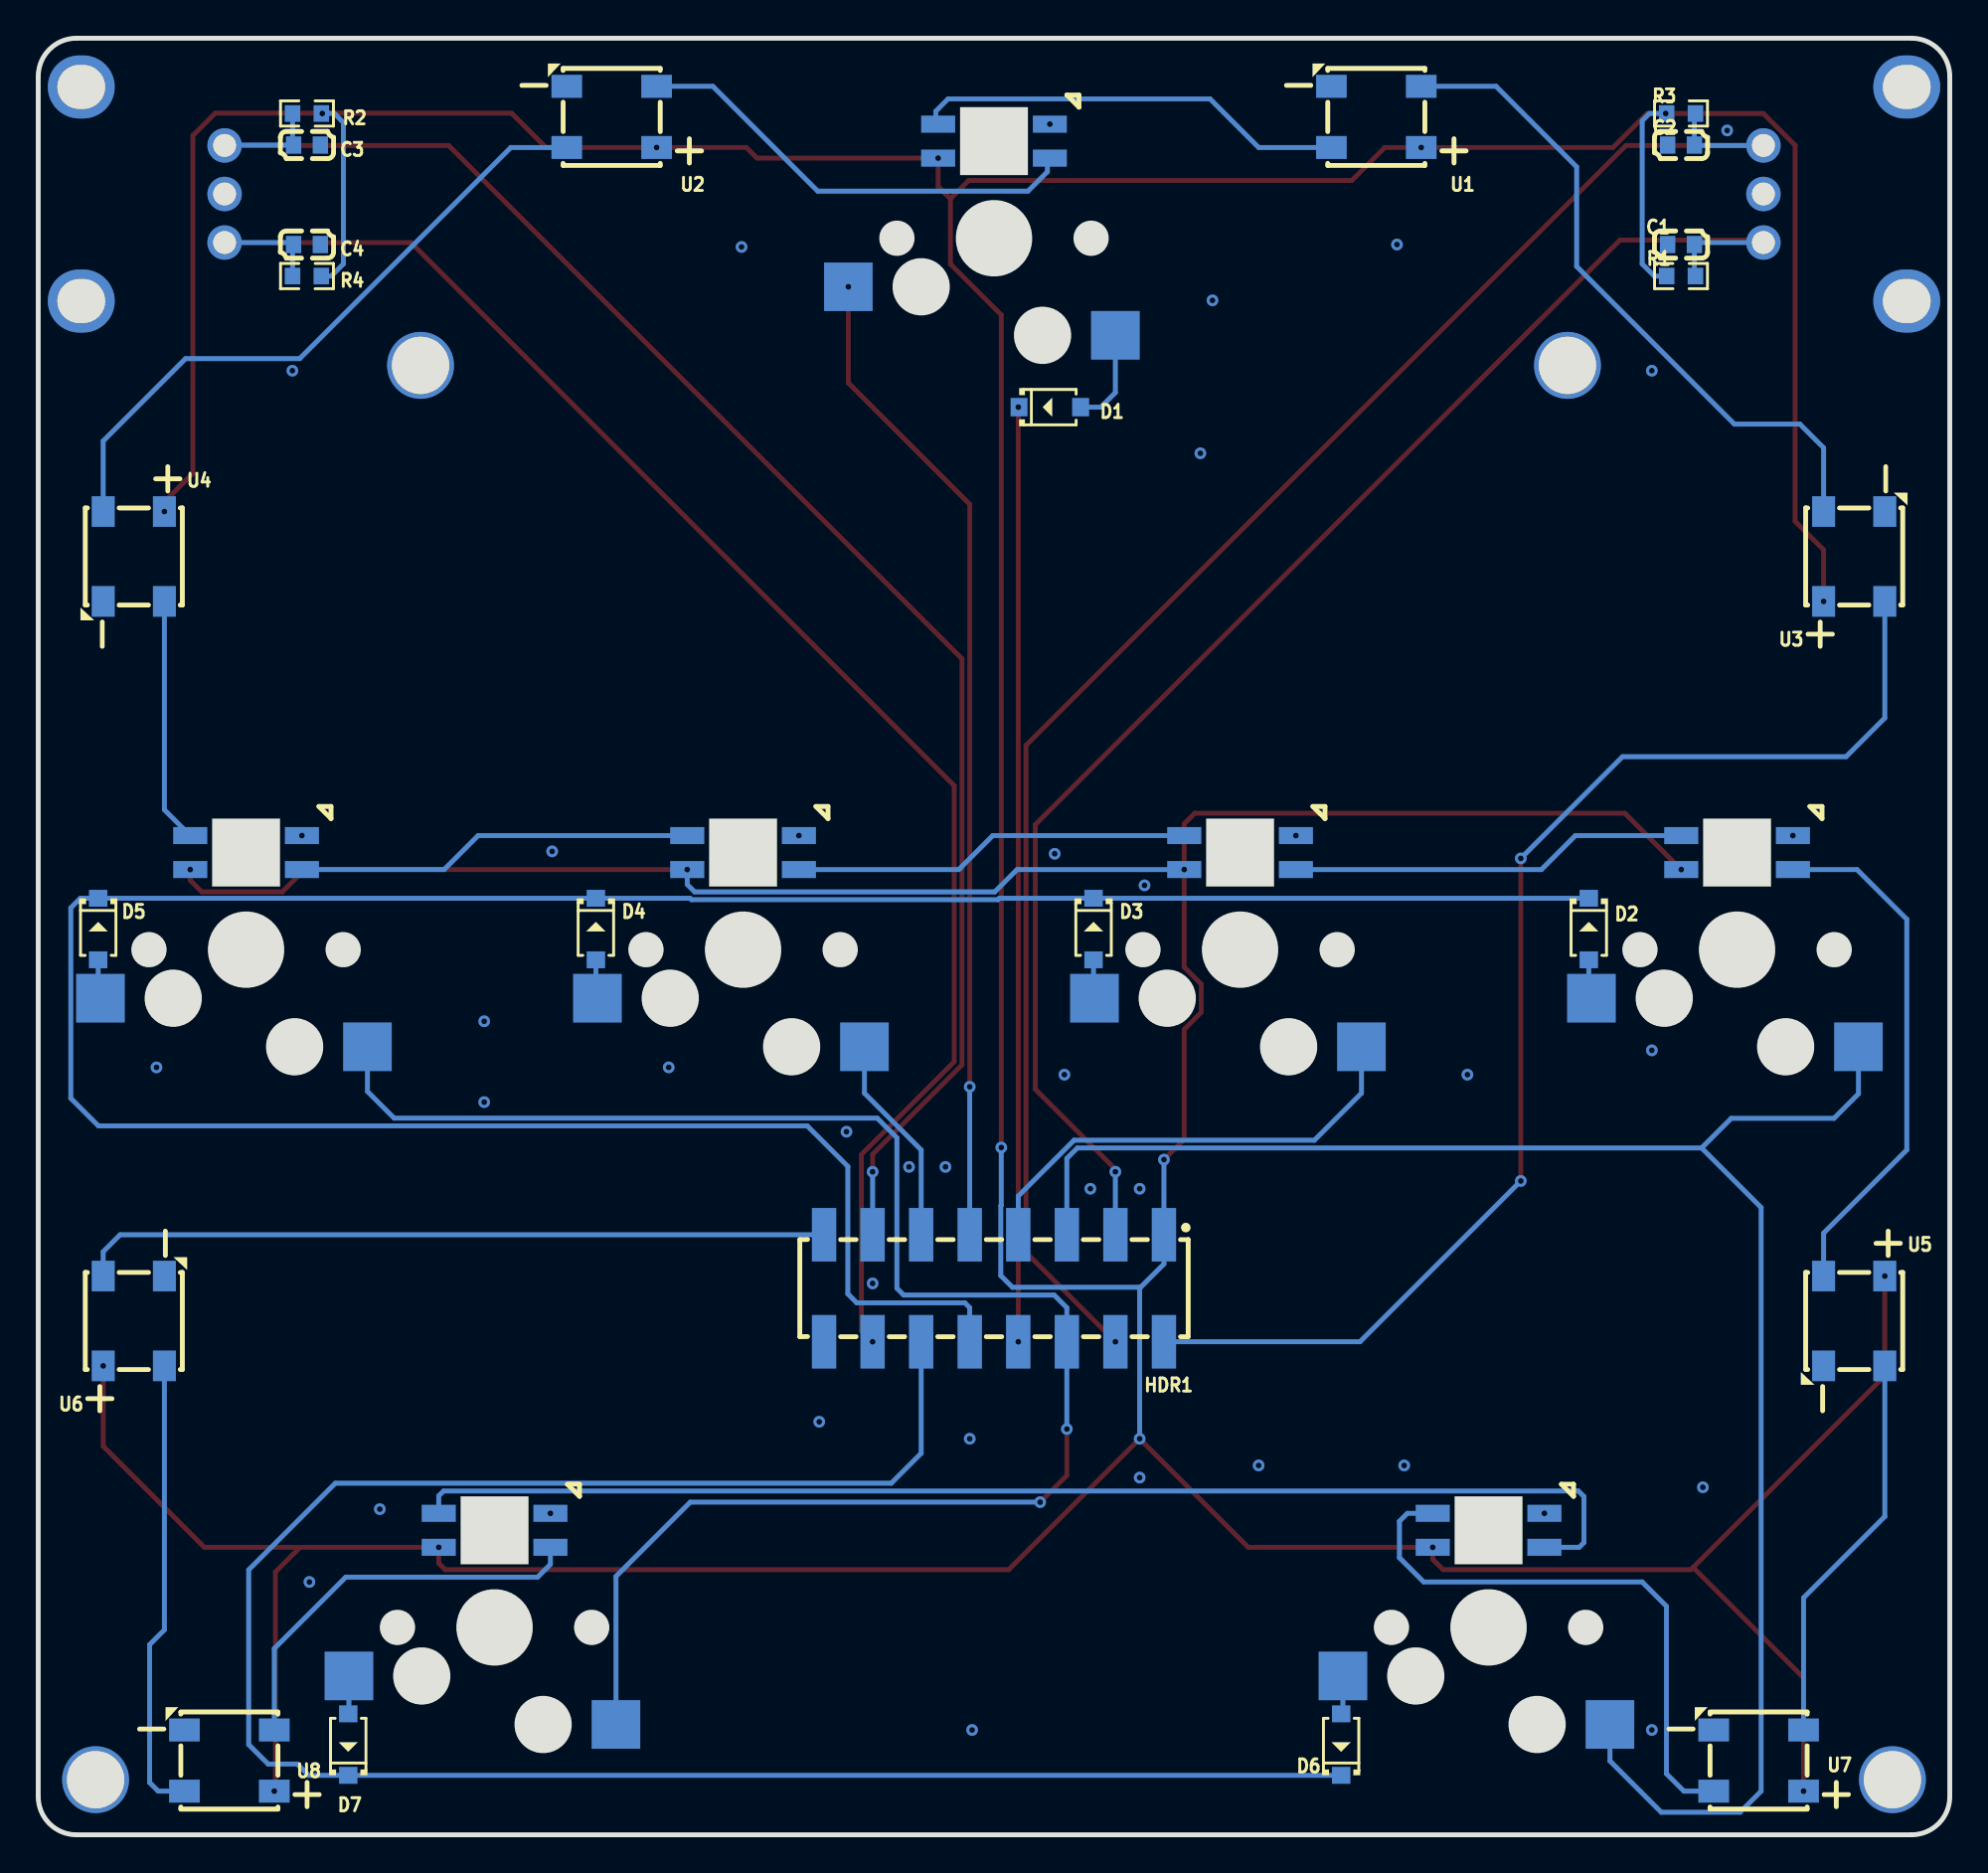
[diagram p8: board, bottom side, seen from below]

Outline 100 x 94 mm; copper layers: Top Layer, Bottom Layer. Coordinates in mm from the lower left corner of the outline.
Outline path: 0,92 0,2 arc(0.59,0.59) 2,0 98,0 arc(99.41,0.59) 100,2 100,92 arc(99.41,93.41) 98,94 2,94 arc(0.59,93.41) 0,92
Stack: Top Layer 0.035mm / Dielectric1 1.51mm FR4 er 4.5 / Bottom Layer 0.035mm

## Design rules (mm)
spacing safeClearance (default): track to track 0.152, other pairs 0.152 to 0.3
track width trackWidth (default): min 0.127, default 0.254, max 2.54
track width trackWidth1: min 0.127, default 0.508, max 2.54
differential pair differentialPair (default): width min 0.127, default 0.254, max 2.54; gap min 0.152, default 0.152
via viaSize (default): diameter min 0.5, default 0.61, max 10; hole min 0.3, default 0.305, max 6
net +5V uses trackWidth1

## Placement (name value [footprint] x y rotation side)
C1  100nF  [C0603]  14.06 83.21 180 bottom
C2  100nF  [C0603]  14.06 88.41 180 bottom
C3  100nF  [C0603]  85.94 88.41 0 bottom
C4  100nF  [C0603]  85.94 83.21 0 bottom
D1  1N4148W  [SOD-123_L2.7-W1.6-LS3.7-FD]  47.08 74.7 0 bottom
D2  1N4148W  [SOD-123_L2.7-W1.6-LS3.7-FD]  18.89 47.39 90 bottom
D3  1N4148W  [SOD-123_L2.7-W1.6-LS3.7-FD]  44.79 47.39 90 bottom
D4  1N4148W  [SOD-123_L2.7-W1.6-LS3.7-FD]  70.83 47.39 90 bottom
D5  1N4148W  [SOD-123_L2.7-W1.6-LS3.7-FD]  96.86 47.39 90 bottom
D6  1N4148W  [SOD-123_L2.7-W1.6-LS3.7-FD]  31.84 4.72 270 bottom
D7  1N4148W  [SOD-123_L2.7-W1.6-LS3.7-FD]  83.78 4.72 270 bottom
EC1  -  [SW-TH_EC12EXXXX]  6 85.85 90 top
EC2  -  [SW-TH_EC12EXXXX]  94 85.85 270 top
HDR1  PZ254-2-08-S  [HDR-SMD_16P-P2.54-V-M-R2-C8-S7.4]  50 28.59 0 bottom
NOREF  -  [Pad_e3634]  80 76.88 0 top
NOREF#2  -  [Pad_e3498]  3 2.88 0 top
NOREF#3  -  [Pad_e3635]  20 76.88 0 top
NOREF#4  -  [Pad_e3496]  97 2.88 0 top
R1  10K  [R0603]  14.06 81.55 0 bottom
R2  10K  [R0603]  85.94 90.06 180 bottom
R3  10K  [R0603]  14.06 90.06 0 bottom
R4  10K  [R0603]  85.94 81.55 180 bottom
SW1  凯华轴座  [凯华轴座+3528反贴灯]  50 83.54 0 top
SW2  凯华轴座  [凯华轴座+3528反贴灯]  11.13 46.31 0 top
SW3  凯华轴座  [凯华轴座+3528反贴灯]  37.13 46.31 0 top
SW4  凯华轴座  [凯华轴座+3528反贴灯]  63.13 46.31 0 top
SW5  凯华轴座  [凯华轴座+3528反贴灯]  89.13 46.31 0 top
SW6  凯华轴座  [凯华轴座+3528反贴灯]  24.13 10.85 0 top
SW7  凯华轴座  [凯华轴座+3528反贴灯]  76.13 10.85 0 top
U1  WS2812  [LED-SMD_4P-L5.0-W5.0-TL-A]  30 89.88 0 bottom
U2  WS2812  [LED-SMD_4P-L5.0-W5.0-TL-A]  70 89.88 0 bottom
U3  WS2812  [LED-SMD_4P-L5.0-W5.0-TL-A]  5 66.88 90 bottom
U4  WS2812  [LED-SMD_4P-L5.0-W5.0-TL-A]  95 66.88 270 bottom
U5  WS2812  [LED-SMD_4P-L5.0-W5.0-TL-A]  5 26.88 270 bottom
U6  WS2812  [LED-SMD_4P-L5.0-W5.0-TL-A]  95 26.88 90 bottom
U7  WS2812  [LED-SMD_4P-L5.0-W5.0-TL-A]  10 3.88 0 bottom
U8  WS2812  [LED-SMD_4P-L5.0-W5.0-TL-A]  90 3.88 0 bottom
U9  -  [SDVX台板框]  50 47.01 0 top

## Footprints (pads in the part's own frame, mm; a bottom-side part is the same pattern mirrored in y, then rotated)
C0603
  rect 0.8x0.9 smd: 1(-0.7,0) 2(0.7,0)
HDR-SMD_16P-P2.54-V-M-R2-C8-S7.4
  rect 1.27x2.8 smd: 1(-8.89,-2.8) 2(-8.89,2.8) 3(-6.35,-2.8) 4(-6.35,2.8) 5(-3.81,-2.8) 6(-3.81,2.8) 7(-1.27,-2.8) 8(-1.27,2.8) 9(1.27,-2.8) 10(1.27,2.8) 11(3.81,-2.8) 12(3.81,2.8) 13(6.35,-2.8) 14(6.35,2.8) 15(8.89,-2.8) 16(8.89,2.8)
LED-SMD_4P-L5.0-W5.0-TL-A
  rect 1.6x1.2 smd: 1(-2.35,1.6) 2(-2.35,-1.6) 3(2.35,-1.6) 4(2.35,1.6)
Pad_e3496
  round 3.5 hole 3: 1(0,0)
Pad_e3498
  round 3.5 hole 3: 1(0,0)
Pad_e3634
  round 3.5 hole 3: 1(0,0)
Pad_e3635
  round 3.5 hole 3: 1(0,0)
R0603
  rect 0.806x0.864 smd: 1(-0.753,0) 2(0.753,0)
SOD-123_L2.7-W1.6-LS3.7-FD
  rect 0.88x0.96 smd: 1(-1.61,0) 2(1.61,0)
SW-TH_EC12EXXXX
  round 1.801 hole 1.199: A(-2.54,-3.749) B(2.54,-3.749) C(0,-3.749)
  oval 3.3x3.5 hole 2.301x2.499: D(5.601,3.749) E(-5.601,3.749)
凯华轴座+3528反贴灯
  rect 1.778x0.889 smd far side: 1(2.921,4.191) 2(2.921,5.969) 5(-2.921,5.969) 6(-2.921,4.191)
  rect 2.54x2.54 smd far side: 3(-6.35,-5.08) 4(7.62,-2.54)

## Nets
As in the schematic, except:
GND: C1.1 C2.1 C3.1 C4.1 EC1.C EC1.D EC1.E EC2.C EC2.D EC2.E HDR1.16 NOREF.1 NOREF#2.1 NOREF#3.1 NOREF#4.1 SW1.5 SW2.5 SW3.5 SW4.5 SW5.5 SW6.5 SW7.5 U1.3 U2.3 U3.3 U4.3 U5.3 U6.3 U7.3 U8.3

## Via types
v1: diameter 0.61, hole 0.305, Top Layer to Bottom Layer, 72 vias

## Routing (per net, layer and track width the routed paths; a pad name or vN(x,y) marks a point on that pad's centre or on a via; arc(x,y) is an arc through that point)
+5V: length 479.4
  Top Layer w0.254: 13.42,13.99 3.4,24.01 v1(3.4,29.23) ; 13.42,13.99 13.54,13.87 26.5,13.87 27.05,14.42 v1(27.05,15.04) 36.7,15.04 v1(42.38,20.72) 49.23,13.87 78.71,13.87 79.05,14.21 v1(79.05,15.04) 86.3,15.04 ; 13.42,13.99 7.65,8.22 v1(7.65,2.28) ; v1(93.4,69.23) 93.4,69.74 91.91,71.23 91.91,88.91 90.74,90.08 75.24,90.08 73.44,88.28 v1(67.65,88.28) 62.95,88.28 62.4,87.73 v1(52.92,87.73) 52.92,86.24 52.28,85.6 ; v1(6.6,64.53) 6.6,67.23 8.09,68.72 8.09,88.4 9.75,90.06 v1(14.86,90.06) 15.84,90.06 17.62,88.28 v1(27.65,88.28) 29.56,88.28 31.28,86.56 51.32,86.56 52.28,85.6 ; v1(14.05,50.5) 16.99,53.45 39.5,53.45 40.05,52.9 v1(40.05,50.5) 40.05,45.4 39.16,44.51 39.16,43.03 40.05,42.14 40.05,36.39 v1(41.11,35.33) ; 86.3,15.04 87.59,13.75 87.59,2.34 v1(87.65,2.28) ; 86.3,15.04 91.31,15.04 96.6,20.33 v1(96.6,24.53) ; 52.28,85.6 52.28,82.18 49.62,79.52 v1(49.62,35.96) ; v1(92.05,50.5) 92.05,49.94 91.44,49.33 87.23,49.33 86.06,50.5 v1(66.05,50.5)
  Bottom Layer w0.254: 42.38,28.65 42.33,28.65 41.11,29.87 HDR1.1 v1(41.11,35.33) ; 42.38,28.65 49.03,28.65 49.64,29.26 49.64,32.91 49.62,32.94 v1(49.62,35.96) ; 42.38,28.65 v1(42.38,20.72) ; v1(66.05,50.5) 66.05,49.72 65.66,49.33 49.96,49.33 48.79,50.5 v1(40.05,50.5) ; v1(14.86,90.06) 15.71,90.06 16.09,89.68 16.09,82.19 15.46,81.55 R1.2 ; R4.2 84.67,81.55 84.04,82.19 84.04,89.59 84.51,90.06 v1(85.14,90.06)
GND:
  vias: v1(8.21,52.28) v1(11.65,89.17) v1(12.92,18.18) v1(15.59,76.6) v1(15.59,41.04) v1(15.59,5.48) v1(21.21,16.82) v1(25.23,39.77) v1(28.54,19.32) v1(28.92,83.21) v1(34.21,52.28) v1(36.16,19.32) v1(38.57,80.28) v1(39.21,72.28) v1(42.13,49.68) v1(42.38,33.8) v1(42.38,18.69) v1(44.96,33.8) v1(46.32,39.77) v1(46.82,51.33) v1(47.08,89.5) v1(51.15,5.48) v1(51.27,20.72) v1(52.54,34.95) v1(54.44,34.95) v1(56.35,28.85) v1(57.72,36.79) v1(59.14,21.61) v1(60.21,52.28) v1(63.21,83.08) v1(67.02,40.15) v1(73.11,51.46) v1(73.21,16.82) v1(76.67,42.57) v1(76.67,38.33) v1(82.13,17.04) v1(85.81,13.23) v1(86.21,52.28) v1(86.71,76.6) v1(93.81,40.15)
COL0: length 95.6
  Bottom Layer w0.254: 12.98,35.94 11.43,37.49 6.06,37.49 4.78,38.77 SW2.3 ; 12.98,35.94 9.87,32.82 9.87,2.28 10.97,1.18 15.09,1.18 17.78,3.87 SW6.3 ; 12.98,35.94 45.64,35.94 46.19,35.39 HDR1.5
COL1: length 24.6
  Bottom Layer w0.254: HDR1.7 48.73,33.42 45.81,36.34 33.24,36.34 30.78,38.8 30.78,41.23
COL2: length 52.2
  Top Layer w0.254: v1(51.27,39.14) 51.27,69.62 57.62,75.97 v1(57.62,81)
  Bottom Layer w0.254: HDR1.9 v1(51.27,39.14)
COL3: length 11.1
  Bottom Layer w0.254: HDR1.11 53.81,35.83 56.78,38.8 56.78,41.23
COL4: length 90.5
  Top Layer w0.254: v1(46.19,21.23) 46.19,18.8 v1(47.59,17.4)
  Bottom Layer w0.254: v1(47.59,17.4) 65.89,17.4 69.78,13.52 69.78,5.77 ; 82.78,41.23 82.78,38.89 81.38,37.5 56.11,37.5 55.08,36.47 55.08,28.59 54.72,28.24 46.85,28.24 46.19,27.58 HDR1.6 v1(46.19,21.23)
EC1_A: length 79.3
  Top Layer w0.254: v1(43.65,34.69) 43.65,34.82 47.84,39.01 47.84,52.85 17.26,83.44 9.88,83.44 9.75,83.31
  Bottom Layer w0.254: R1.1 13.36,81.61 C1.2 13.25,83.31 9.75,83.31 ; HDR1.3 v1(43.65,34.69)
EC1_B: length 90
  Top Layer w0.254: v1(43.65,25.8) 48.32,30.47 48.32,57 16.94,88.39 EC1.B
  Bottom Layer w0.254: R3.1 13.36,90.01 C2.2 13.34,88.39 EC1.B
EC2_A: length 87.1
  Top Layer w0.254: EC2.A 78.53,88.39 51.68,61.53 51.68,40.28 56.35,35.61 v1(56.35,34.69)
  Bottom Layer w0.254: HDR1.13 v1(56.35,34.69) ; R2.1 86.69,88.47 C3.2 90.23,88.41 EC2.A
EC2_B: length 86.6
  Top Layer w0.254: 90.25,83.31 80.5,83.31 52.08,54.9 52.08,40.45 56.93,35.6 56.93,26.38 v1(56.35,25.8)
  Bottom Layer w0.254: R4.1 86.69,83.15 C4.2 86.75,83.31 90.25,83.31
LED_IN: length 39.4
  Bottom Layer w0.254: U6.4 96.6,30.51 95.71,31.4 HDR1.15
RGB_EX: length 67.2
  Top Layer w0.254: v1(22.44,51.09) v1(22.44,34.21)
  Bottom Layer w0.254: v1(22.44,34.21) 30.85,25.8 HDR1.2 ; U3.2 3.4,58.43 5.42,56.41 17.12,56.41 v1(22.44,51.09)
ROW0: length 48.9
  Top Layer w0.254: v1(48.73,74.7) v1(48.73,25.8)
ROW1: length 146.9
  Bottom Layer w0.254: D2.2 D3.2 49.72,49 49.79,48.93 65.83,48.93 65.9,49 D4.2 D5.2 97.79,49 98.3,48.5 98.3,38.54 96.85,37.09 59.76,37.09 57.65,34.97 57.65,28.3 57.18,27.83 51.52,27.83 51.27,27.58 HDR1.10
ROW2: length 110.5
  Bottom Layer w0.254: HDR1.12 53.81,19.96 55.38,18.39 84.46,18.39 88.99,13.86 88.99,4.72 87.97,3.7 86.45,3.7 85.85,3.11 D7.2 D6.2
$1N16056: length 20.9
  Bottom Layer w0.254: SW2.2 19.58,52.28 21.36,50.5 SW3.6
$1N16215: length 20.9
  Bottom Layer w0.254: SW4.2 76.99,52.28 78.77,50.5 SW5.6
$1N26478: length 20.9
  Bottom Layer w0.254: SW3.2 50.06,52.28 51.84,50.5 SW4.6
$1N26488: length 24.1
  Bottom Layer w0.254: U6.2 93.4,10.72 94.17,9.95 94.17,2.73 93.72,2.28 U8.4
$1N26494: length 21.4
  Bottom Layer w0.254: SW7.6 73.21,14.15 73.87,13.48 83.91,13.48 87.65,9.74 U8.2
$1N26499: length 65.6
  Bottom Layer w0.254: SW7.2 79.05,17.73 78.79,17.99 19.43,17.99 19.14,17.7 19.14,15.29 19.39,15.04 SW6.6
$1N26504: length 30.5
  Bottom Layer w0.254: SW6.2 28.38,16.82 28.79,16.4 28.79,14.5 27.52,13.23 16.09,13.23 14.82,11.96 14.82,3.2 13.91,2.28 U7.4
$1N26509: length 20.8
  Bottom Layer w0.254: U5.4 3.4,16.65 7.65,12.4 U7.2
$1N26516: length 27.5
  Bottom Layer w0.254: U5.2 6.6,31.48 2.25,35.83 2.25,47.9 4.85,50.5 SW2.6
$1N26529: length 23.8
  Bottom Layer w0.254: U2.2 64.71,91.48 59.22,86 48.22,86 47.21,87.02 47.21,87.73
$1N26533: length 22.7
  Bottom Layer w0.254: U1.4 36.16,88.28 38.7,90.83 52.4,90.83 53.05,90.18 53.05,89.5
$1N26544: length 34.3
  Bottom Layer w0.254: U4.2 96.6,72.93 92.29,77.24 86.32,77.24 75.28,88.28 U2.4
$1N26550: length 12.8
  Bottom Layer w0.254: U4.4 93.4,53.63 SW5.2
$1N26556: length 35.3
  Bottom Layer w0.254: U1.2 23.73,91.48 19.52,87.27 19.52,82.06 11.27,73.81 7.84,73.81 6.6,72.57 U3.4
$1N28171: length 2.1
  Bottom Layer w0.254: D2.1 18.89,43.91 SW2.4
$1N28248: length 2
  Bottom Layer w0.254: D3.1 44.79,43.82 SW3.4
$1N28294: length 2
  Bottom Layer w0.254: D4.1 70.83,43.85 SW4.4
$1N28343: length 2.1
  Bottom Layer w0.254: D5.1 96.86,43.89 SW5.4
$1N28396: length 2
  Bottom Layer w0.254: SW6.4 31.75,6.42 D6.1
$1N28439: length 2
  Bottom Layer w0.254: SW7.4 83.75,6.36 D7.1
$1N29403: length 5.1
  Bottom Layer w0.254: D1.1 44.41,74.7 43.65,75.46 SW1.3

## Copper pours and planes (outline as drawn; the poured copper is in the pictures)
GND on Top Layer: -5.5,95.78 104.1,95.78 104.1,-2.9 -5.5,-2.9
GND on Bottom Layer: -10.33,99.72 106.9,99.72 106.9,-3.66 -10.33,-3.66

## Text on the board
Top Silkscreen Layer: DESIGNED-BY-SKINOASU | SDVX-CON
